# EAGLE board KickerBoard-new-small (EAGLE 9.3.0)
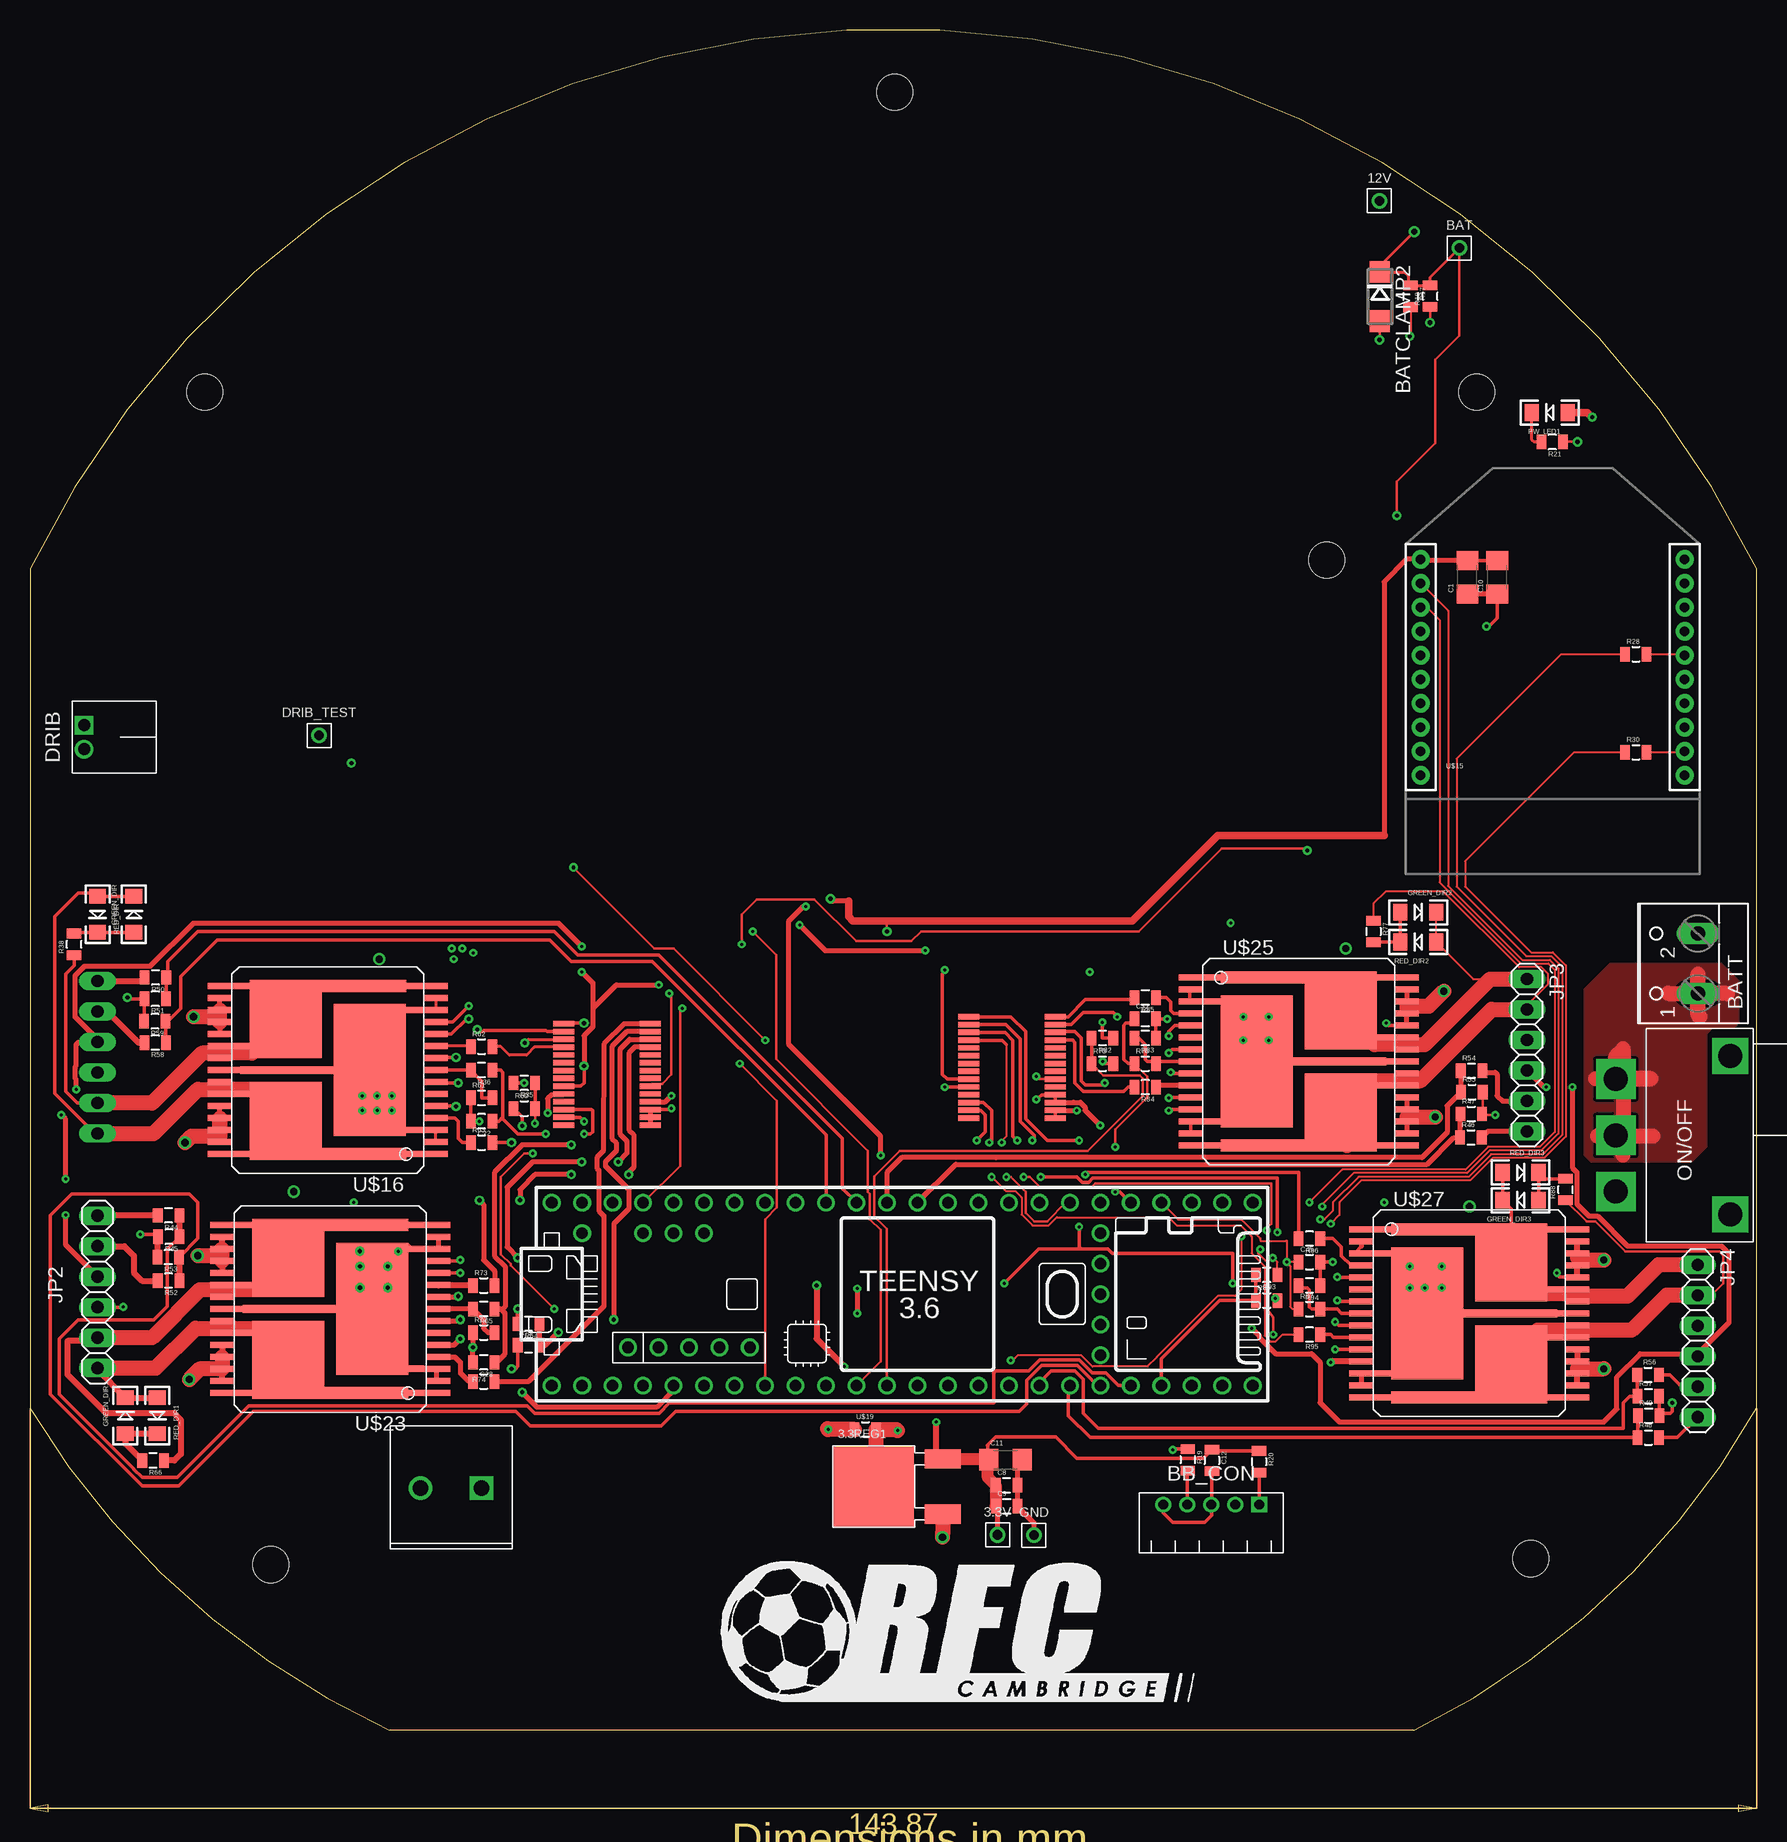
[diagram p2: board, top side]
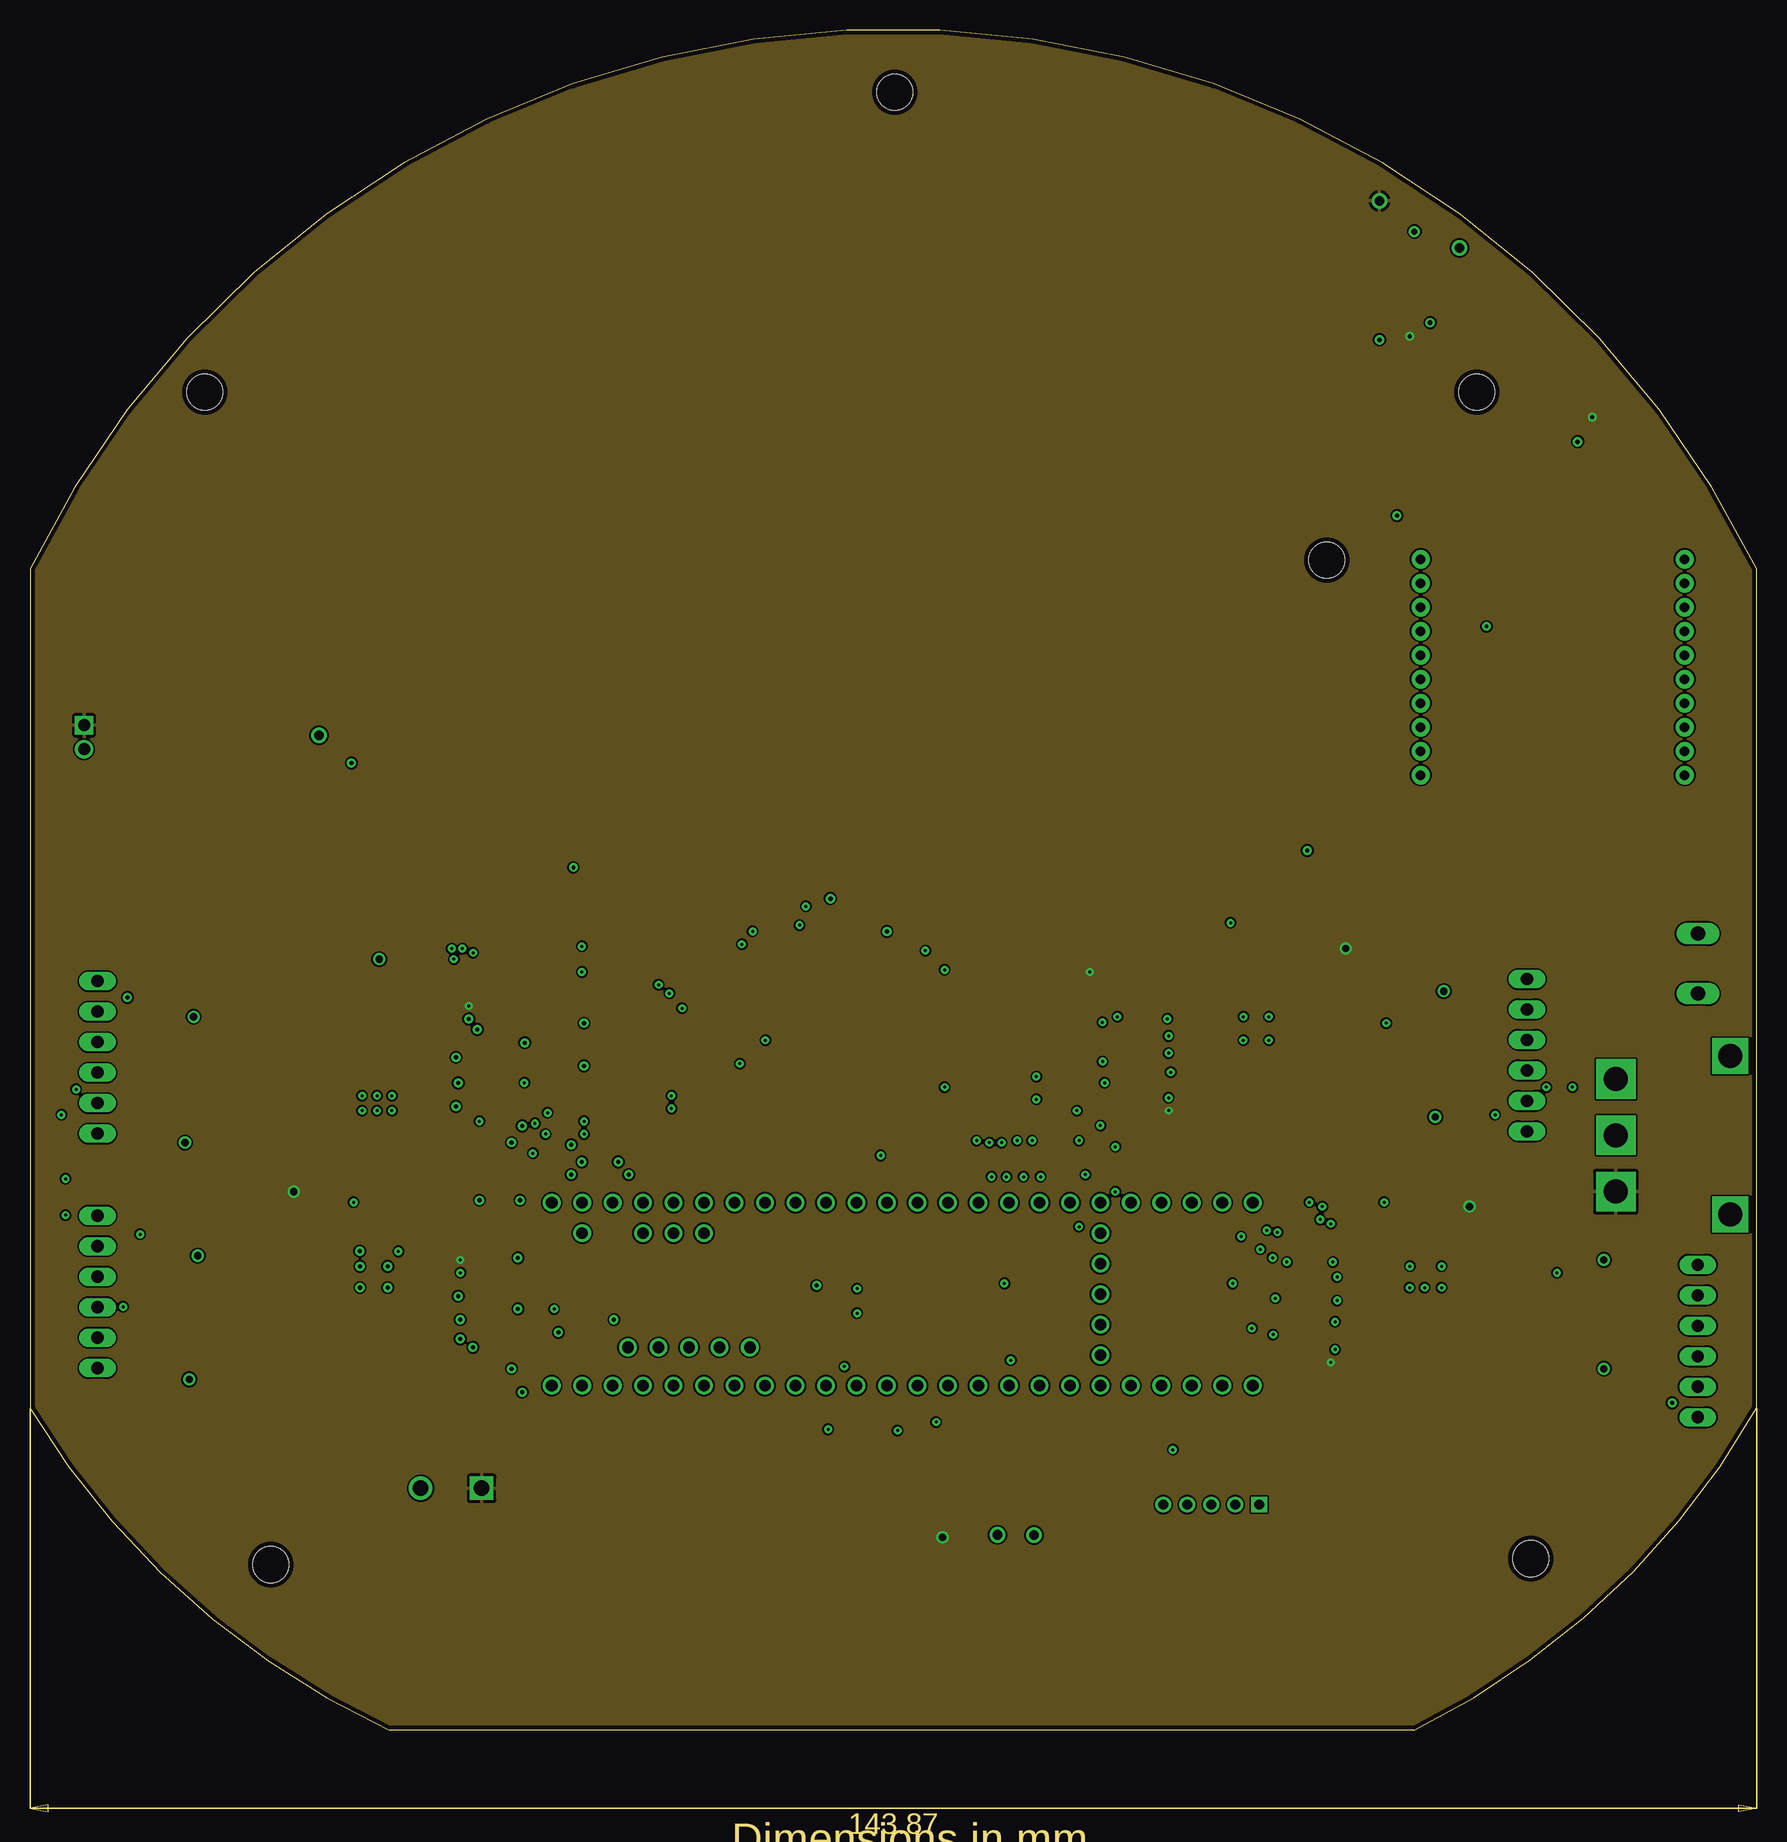
[diagram p3: board, inner layer 12V+]
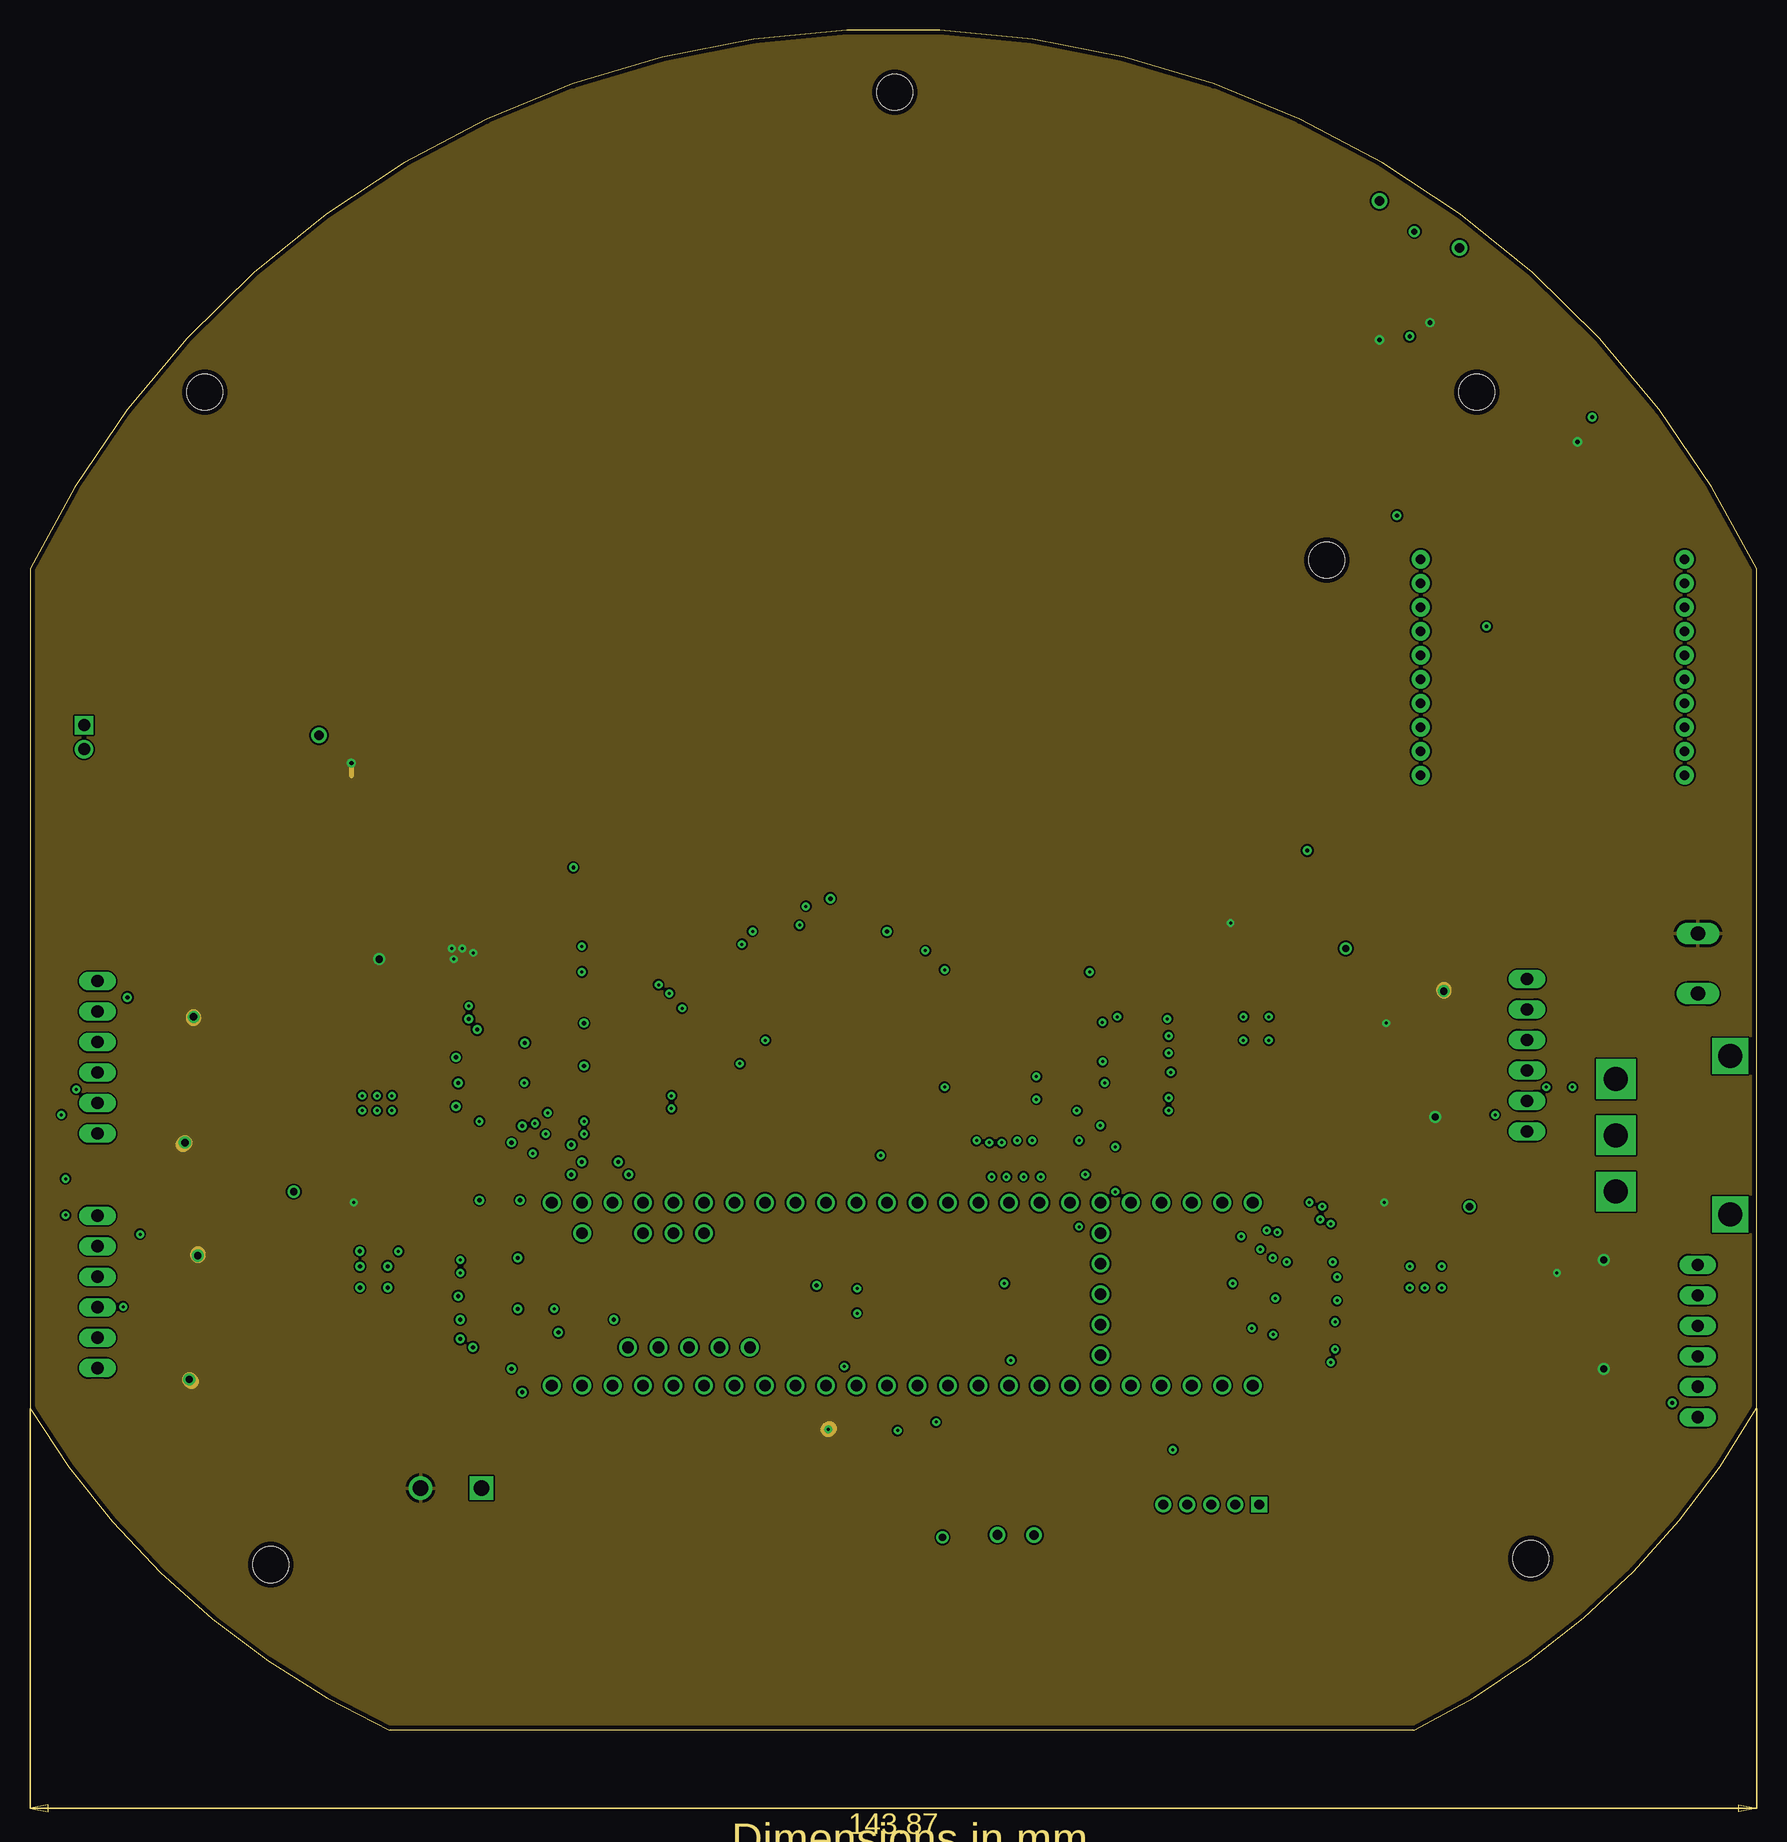
[diagram p4: board, inner layer 12VGND]
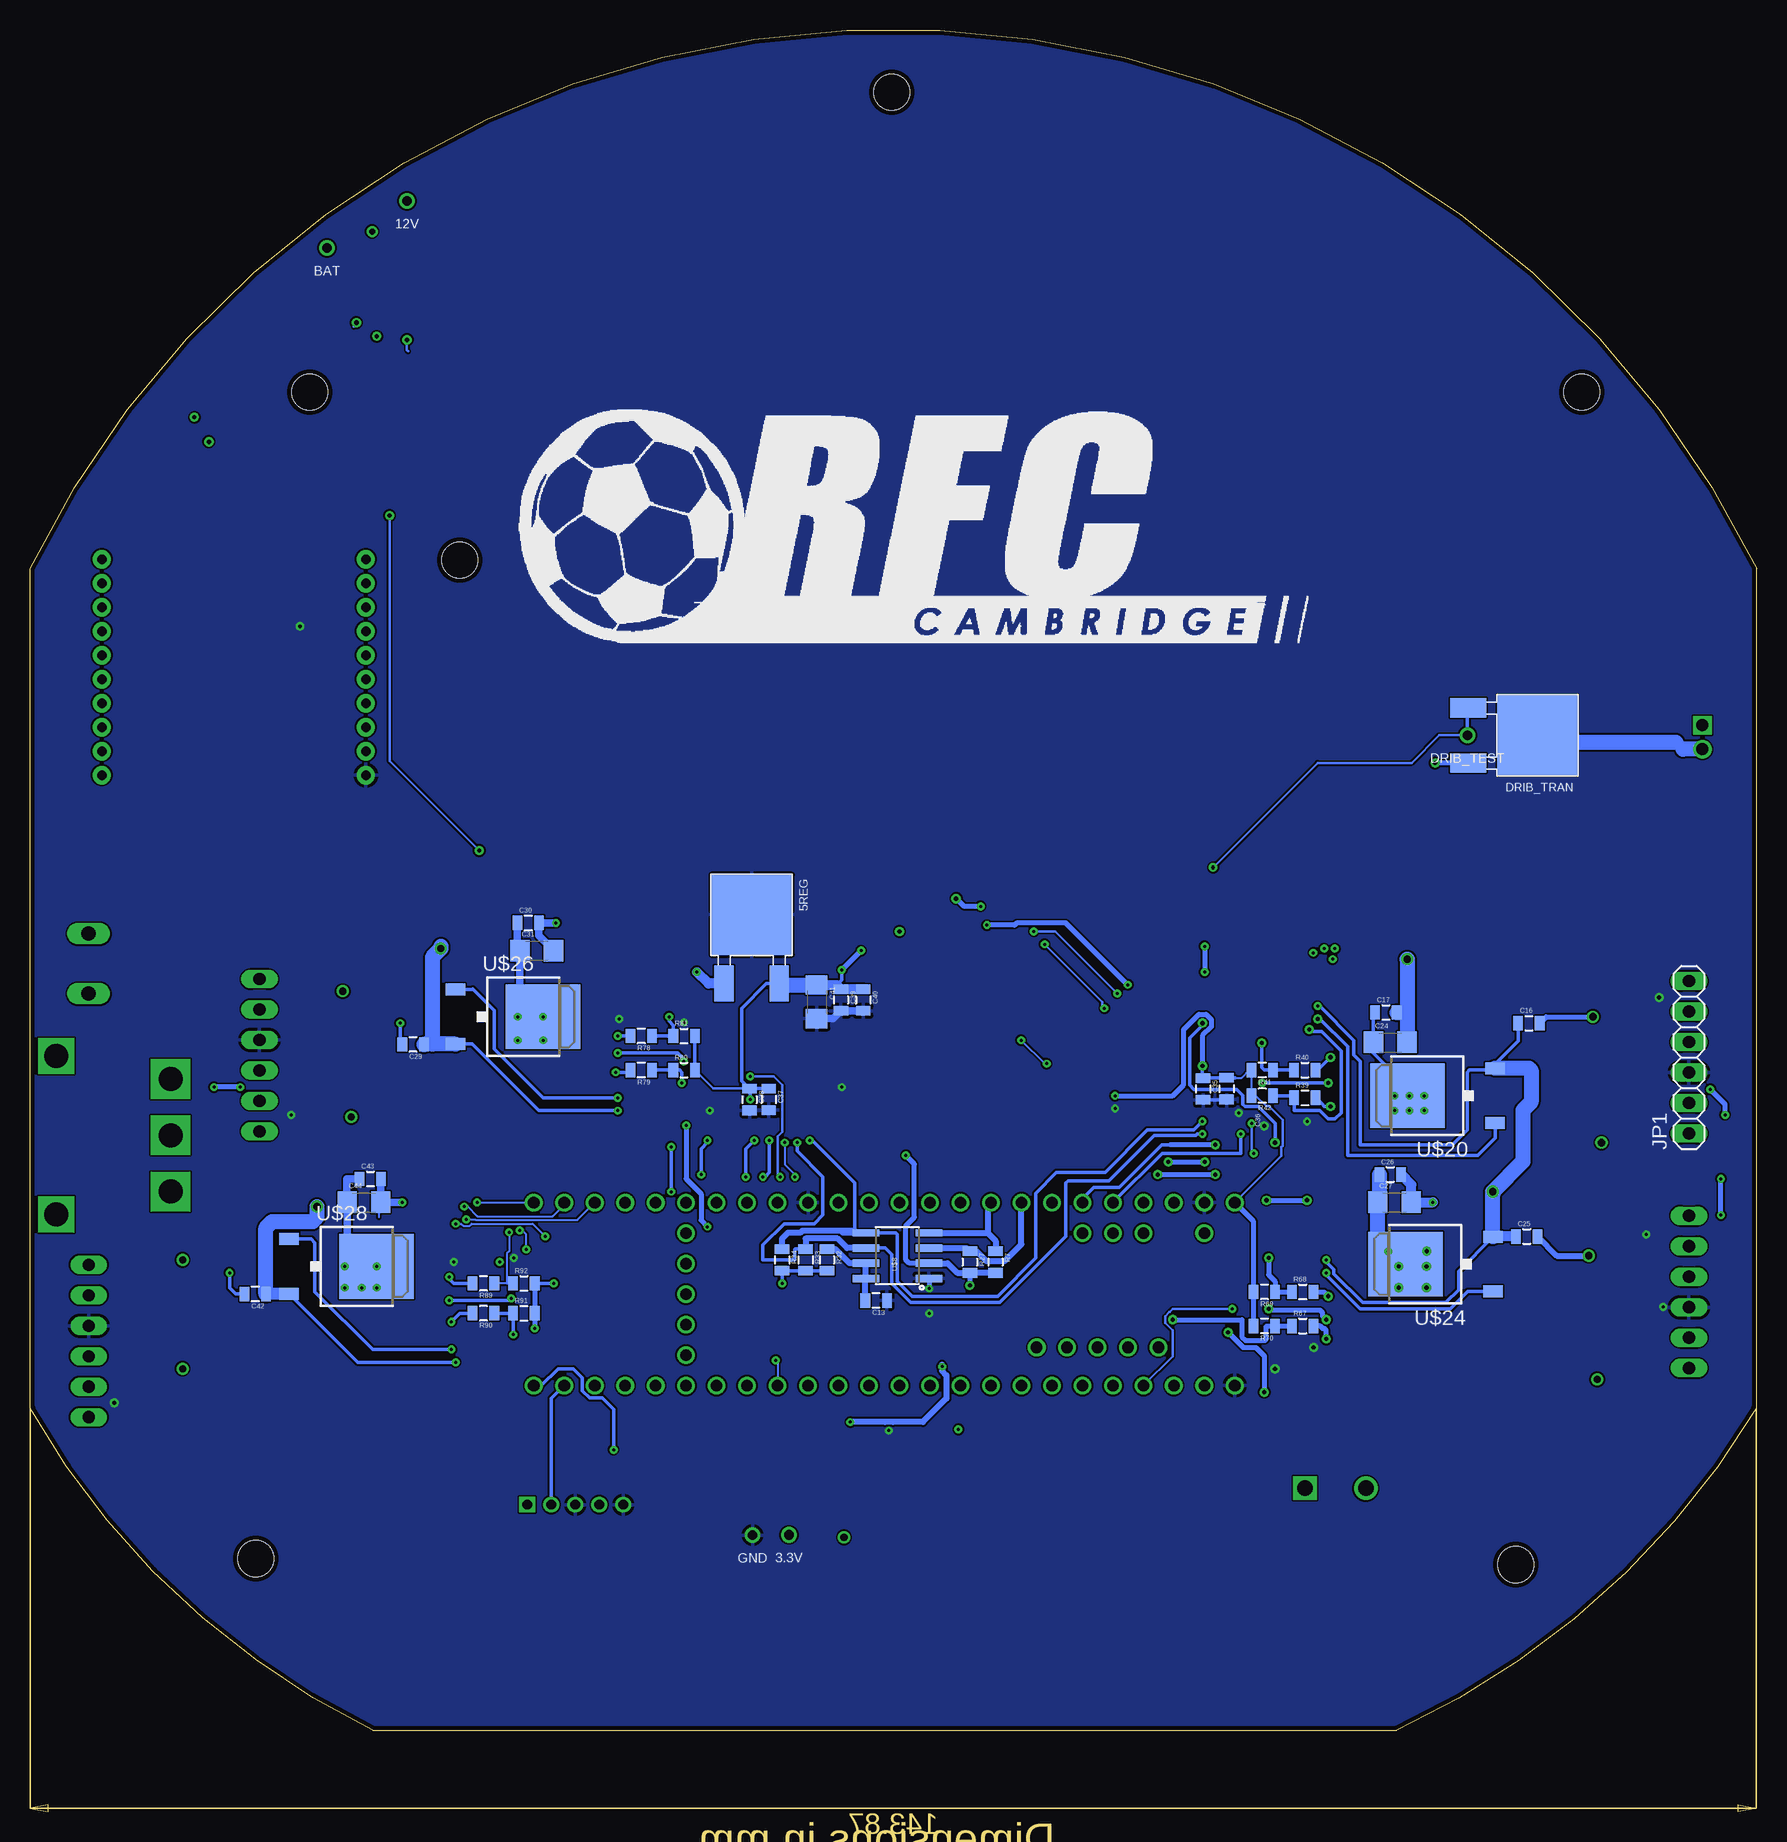
[diagram p5: board, bottom side, seen from below]

Size 143.88 x 141.72 mm. Coordinates in mm from the lower left corner, seen from the top.
Outline: 143.88,26.82 143.88,96.81 arc128 0,96.81 0,26.82 arc34 29.98,0 115.32,0 arc34 143.88,26.82
Copper layers (1*2*3*16): Top(3v3+) 0.035559375mm / dielectric 0.62mm / 12V+ 0.035559375mm / dielectric 0.62mm / 12VGND 0.035559375mm / dielectric 0.62mm / Bottom(3v3GND) 0.035559375mm
Design rules "typical_4pcb *": minimum track width 6mil, minimum drill 8mil, track to track 6mil, track to pad 6mil, pad to pad 6mil, via to via 6mil, smd to smd 6mil, copper to edge 15mil, drill to drill 8mil, minimum pad ring 10mil, minimum via ring 8mil, stop-mask expansion 4mil, vias tented up to drill 0mil, thermal gap 10mil
Holes 3 mm at 125.07,14.3 20.07,13.8 14.57,111.52 72.07,136.52 108.07,97.52 120.57,111.52

## Footprints (pad centres in the part's own frame; a part is rotated, then mirrored left to right if it is on the bottom)
DPAK = smd 6.7 x 6.7: DRAIN 0,0 | smd 3 x 1.6: GATE 5.75,-2.3; SOURCE 5.75,2.3
TESTING_PT = drill 0.8: P$1 0,0
DO214AC = smd 1.8 x 1.7: A 2.05,0; C -2.05,0
W237-102 = drill 1.194 long: 1 -2.5,-1.27; 2 2.5,-1.27
JST-5-2MM = drill 0.8 square: 1 4,0 | drill 0.8: 2 2,0; 3 0,0; 4 -2,0; 5 -4,0
1206 = smd 1.6 x 1.8: 1 -1.4,0; 2 1.4,0
0805 = smd 0.8 x 1.2: 1 -0.9,0; 2 0.9,0
JST-2-2MM = drill 1 square: 1 1,1 | drill 1: 2 -1,1
LED-1206 = smd 1.2 x 1.4: A -1.5,0; C 1.5,0
1X06 = drill 1.016 long: 1 -6.35,0; 2 -3.81,0; 3 -1.27,0; 4 1.27,0; 5 3.81,0; 6 6.35,0
CK_SWITCH = drill 2 pad 3.302 square: COM 0,0; IN1 4.699,0; IN2 -4.699,0 | drill 2 pad 2.54 square: SUP1 -6.604,-9.525; SUP2 6.604,-9.525
SOIC8 = smd 0.61 x 2.21: 1 -1.905,-2.616; 2 -0.635,-2.616; 3 0.635,-2.616; 4 1.905,-2.616; 5 1.905,2.616; 6 0.635,2.616; 7 -0.635,2.616; 8 -1.905,2.616
1X02-PHEONIX = drill 1.3 square: 1 0,0 | drill 1.3: 2 5.08,0
TEENSY_3.5/3.6 = drill 0.965: 0/RX -25.4,-7.62; 1/TX -22.86,-7.62; 2 -20.32,-7.62; 3/CANTX -17.78,-7.62; 3V3 7.62,-7.62; 3V3_2 17.78,-2.54; 3V3_LO -22.86,7.62; 4/CANRX -15.24,-7.62; 5 -12.7,-7.62; 6 -10.16,-7.62; 7 -7.62,-7.62; 8 -5.08,-7.62; 9/CS -2.54,-7.62; 10/CS 0,-7.62; 11/MOSI 2.54,-7.62; 12/MISO 5.08,-7.62; 13/SCK 5.08,7.62; 14/A0 2.54,7.62; 15/A1 0,7.62; 16/A2 -2.54,7.62; 17/A3 -5.08,7.62; 18/A4/SDA -7.62,7.62; 19/A5/SCL -10.16,7.62; 20/A6 -12.7,7.62; 21/A7 -15.24,7.62; 21/DAC0 12.7,7.62; 22/A8 -17.78,7.62; 23/A9 -20.32,7.62; 24 10.16,-7.62; 25 12.7,-7.62; 26 15.24,-7.62; 27 17.78,-7.62; 28 20.32,-7.62; 29 22.86,-7.62; 30 25.4,-7.62; 31/A12 27.94,-7.62; 32/A13 30.48,-7.62; 33/A14 30.48,7.62; 34/A15 27.94,7.62; 35/A16 25.4,7.62; 36/A17 22.86,7.62; 37/A18 20.32,7.62; 38/A19 17.78,7.62; 39/A20 15.24,7.62; A10 -17.78,5.08; A11 -15.24,5.08; A22/DAC1 10.16,7.62; AGND -25.4,7.62; AREF -20.32,5.08; GND -27.94,-7.62; GND2 7.62,7.62; GND3 17.78,0; PROG 17.78,2.54; RESET 17.78,5.08; U5V -21.59,-4.445; UD+ -16.51,-4.445; UD- -19.05,-4.445; UGND1 -13.97,-4.445; UGND2 -11.43,-4.445; VBAT 17.78,-5.08; VIN -27.94,7.62; VUSB -25.4,5.08
XBEE-1 = drill 0.8 pad 1.524: 1 -11,20; 2 -11,18; 3 -11,16; 4 -11,14; 5 -11,12; 6 -11,10; 7 -11,8; 8 -11,6; 9 -11,4; 10 -11,2; 11 11,2; 12 11,4; 13 11,6; 14 11,8; 15 11,10; 16 11,12; 17 11,14; 18 11,16; 19 11,18; 20 11,20
MULTIPOWERSO-30 = smd 0.508 x 12: 1 -7,-4; 15 7,-4; 16 7,4; 30 -7,4 | smd 0.508 x 2: 2 -6,-9; 4 -4,-9; 5 -3,-9; 6 -2,-9; 7 -1,-9; 8 0,-9; 9 1,-9; 10 2,-9; 11 3,-9; 12 4,-9; 14 6,-9; 17 6,9; 18 5,9; 19 4,9; 20 3,9; 22 1,9; 24 -1,9; 26 -3,9; 27 -4,9; 28 -5,9; 29 -6,9 | smd 0.508 x 4: 3 -5,-8; 13 5,-8; 21 2,8; 23 0,8; 25 -2,8 | smd 6.5 x 6: OUTA -4.25,3.5; OUTB 4.25,3.5 | smd 1 x 7.5: OUTA@1 -7,-2.755; OUTB@1 7,-2.755 | smd 11 x 6: VCC 0,-3.5 | smd 0.65 x 8.3: VCC@1 0,3.145
SSOP = smd 0.45 x 1.75: 1 0,0; 2 0.65,0; 3 1.3,0; 4 1.95,0; 5 2.6,0; 6 3.25,0; 7 3.9,0; 8 4.55,0; 9 5.2,0; 10 5.85,0; 11 6.5,0; 12 7.15,0; 13 7.8,0; 14 8.45,0; 15 8.45,7.2; 16 7.8,7.2; 17 7.15,7.2; 18 6.5,7.2; 19 5.85,7.2; 20 5.2,7.2; 21 4.55,7.2; 22 3.9,7.2; 23 3.25,7.2; 24 2.6,7.2; 25 1.95,7.2; 26 1.3,7.2; 27 0.65,7.2; 28 0,7.2
TO252-3 = smd 1 x 1.6: 1 -2.28,-6.07; 2 2.28,-6.07 | smd 5.4 x 6.2: 3 0,1.23

## Placement (x,y rotation side)
3.3REG1  3.3REG1AREG  [DPAK]  70.31,20.31 0 top
3.3V  TEST_PT  [TESTING_PT]  80.63,16.28 0 top
5REG  3.3REG1AREG  [DPAK]  83.73,67.97 270 bottom
12V  TEST_PT  [TESTING_PT]  112.46,127.47 0 top
BAT  TEST_PT  [TESTING_PT]  119.12,123.54 0 top
BATCLAMP2  DIODE-ZENERDO214AC  [DO214AC]  112.48,119.5 270 top
BATT  [W237-102]  137.72,63.91 90 top
BB_CON  JST-5  [JST-5-2MM]  98.43,18.79 0 top
C1  1uF  [1206]  119.78,96.09 90 top
C8  1uF  [0805]  81.38,20.42 0 top
C9  .01uF  [0805]  81.39,18.66 0 top
C10  .01uF  [1206]  122.27,96.09 90 top
C11  47uF  [1206]  81.29,22.56 0 top
C12  4.7uF  [0805]  98.49,22.48 270 top
C13  100nF  [0805]  73.37,35.82 180 bottom
C16  0.1uF  [0805]  18.96,58.93 0 bottom
C17  0.1uF  [0805]  30.88,59.82 0 bottom
C22  33nF  [0805]  37.63,50.75 180 top
C24  47uF  [1206]  30.52,57.33 0 bottom
C25  0.1uF  [0805]  19.14,41.15 0 bottom
C26  0.1uF  [0805]  30.52,46.31 0 bottom
C27  47uF  [1206]  30.17,44 0 bottom
C28  33nF  [0805]  37.81,30.66 180 top
C29  0.1uF  [0805]  111.95,57.15 180 bottom
C30  0.1uF  [0805]  102.35,67.29 0 bottom
C31  47uF  [1206]  101.64,64.98 0 bottom
C32  33nF  [0805]  92.93,59.29 0 top
C35  100nF  [0805]  46.12,53.45 270 bottom
C36  2.2uF  [0805]  44.16,53.47 270 bottom
C37  100nF  [0805]  82.31,52.58 270 bottom
C38  2.2uF  [0805]  83.91,52.56 270 bottom
C39  1uF  [0805]  76.29,60.86 270 bottom
C40  .01uF  [0805]  74.44,60.86 270 bottom
C41  47uF  [1206]  78.32,60.71 270 bottom
C42  0.1uF  [0805]  125.11,36.35 180 bottom
C43  0.1uF  [0805]  115.51,45.95 0 bottom
C44  47uF  [1206]  116.04,44 0 bottom
C45  33nF  [0805]  106.62,39.02 0 top
DRIB  JST-22MM  [JST-2-2MM]  5.5,82.76 90 top
DRIB_TEST  TEST_PT  [TESTING_PT]  24.09,82.92 0 top
DRIB_TRAN  [DPAK]  18.26,82.92 180 bottom
GND  TEST_PT  [TESTING_PT]  83.66,16.26 0 top
GREEN_DIR  [LED-1206]  8.65,68 90 top
GREEN_DIR1  [LED-1206]  7.94,26.22 90 top
GREEN_DIR2  [LED-1206]  115.69,68.18 0 top
GREEN_DIR3  [LED-1206]  124.22,44.17 180 top
JP1  [1X06]  5.63,56.09 90 bottom
JP2  [1X06]  5.63,36.53 90 top
JP3  [1X06]  124.76,56.26 270 top
JP4  [1X06]  138.98,32.44 270 top
ON/OFF  SPDT-SWITCH  [CK_SWITCH]  132.15,49.59 90 top
PW_LED1  [LED-1206]  126.64,109.83 180 top
R7  4.7k  [0805]  63.41,39.02 270 bottom
R17  80k  [0805]  115.05,119.52 270 top
R18  20k  [0805]  116.68,119.54 90 top
R19  20  [0805]  96.48,22.54 270 top
R20  100  [0805]  102.42,22.38 270 top
R21  1k  [0805]  126.85,107.37 180 top
R27  4.7k  [0805]  65.55,39.02 270 bottom
R28  0  [0805]  133.82,89.69 0 top
R30  0  [0805]  133.82,81.51 0 top
R32  200k  [0805]  77.46,39.2 270 bottom
R33  4.7k  [0805]  79.24,39.2 270 bottom
R34  4.7k  [0805]  81.19,39.2 270 bottom
R35  1k  [0805]  41.19,53.95 180 top
R36  10k  [0805]  37.63,55.02 180 top
R38  4.7k  [0805]  3.67,65.51 90 top
R39  1k  [0805]  37.63,52.71 0 bottom
R40  1k  [0805]  37.63,55.02 0 bottom
R41  1k  [0805]  41.19,55.02 180 bottom
R42  1k  [0805]  41.19,52.89 180 bottom
R44  39k  [0805]  11.55,42.9 180 top
R45  75k  [0805]  11.57,41.13 180 top
R46  39k  [0805]  120.08,49.41 0 top
R47  75k  [0805]  120.11,51.36 0 top
R48  39k  [0805]  134.87,24.39 0 top
R49  75k  [0805]  134.89,26.22 0 top
R50  39k  [0805]  10.46,62.74 180 top
R51  75k  [0805]  10.43,60.96 180 top
R52  39k  [0805]  11.55,37.47 180 top
R53  75k  [0805]  11.52,39.42 180 top
R54  39k  [0805]  120.13,54.97 0 top
R55  75k  [0805]  120.16,53.19 0 top
R56  39k  [0805]  134.84,29.62 0 top
R57  75k  [0805]  134.87,27.84 0 top
R58  39k  [0805]  10.43,57.31 180 top
R59  75k  [0805]  10.41,59.08 180 top
R60  10k  [0805]  41.19,51.82 0 top
R61  1k  [0805]  37.63,52.71 0 top
R62  1k  [0805]  37.63,56.98 0 top
R63  1k  [0805]  37.63,48.98 0 top
R64  1k  [0805]  41.55,33.86 180 top
R65  10k  [0805]  37.81,35.11 180 top
R66  4.7k  [0805]  10.25,22.48 180 top
R67  1k  [0805]  37.81,33.68 0 bottom
R68  1k  [0805]  37.81,36.53 0 bottom
R69  1k  [0805]  41.01,36.53 180 bottom
R70  1k  [0805]  41.01,33.68 180 bottom
R71  10k  [0805]  41.55,32.08 0 top
R72  1k  [0805]  37.81,33.15 0 top
R73  1k  [0805]  37.81,37.06 0 top
R74  1k  [0805]  37.81,29.06 0 top
R75  1k  [0805]  89.37,55.55 0 top
R76  10k  [0805]  92.93,55.55 0 top
R77  4.7k  [0805]  111.95,66.58 270 top
R78  1k  [0805]  92.93,57.87 180 bottom
R79  1k  [0805]  92.93,55.02 180 bottom
R80  1k  [0805]  89.37,55.02 0 bottom
R81  1k  [0805]  89.37,57.87 0 bottom
R82  10k  [0805]  89.37,57.69 180 top
R83  1k  [0805]  92.93,57.69 180 top
R84  1k  [0805]  92.93,53.6 180 top
R85  1k  [0805]  92.93,61.07 180 top
R86  1k  [0805]  103.06,35.82 0 top
R87  10k  [0805]  106.62,35.11 0 top
R88  4.7k  [0805]  127.96,45.06 90 top
R89  1k  [0805]  106.09,37.24 180 bottom
R90  1k  [0805]  106.09,34.75 180 bottom
R91  1k  [0805]  102.71,34.75 0 bottom
R92  1k  [0805]  102.71,37.24 0 bottom
R93  10k  [0805]  103.06,37.95 180 top
R94  1k  [0805]  106.62,37.06 180 top
R95  1k  [0805]  106.62,32.97 180 top
R96  1k  [0805]  106.62,40.97 180 top
RED_DIR  [LED-1206]  5.63,68 270 top
RED_DIR1  [LED-1206]  10.61,26.22 270 top
RED_DIR2  [LED-1206]  115.69,65.69 180 top
RED_DIR3  [LED-1206]  124.22,46.49 0 top
U$8  PCA9306  [SOIC8]  71.59,39.55 90 bottom
U$13  PHEONIX-SCREW-TERM  [1X02-PHEONIX]  37.63,20.17 180 top
U$14  TEENSY_3.5/3.6  [TEENSY_3.5/3.6]  71.42,36.35 0 top
U$15  XBEE-1B1  [XBEE-1]  126.89,77.6 0 top
U$16  VNH5019  [MULTIPOWERSO-30]  24.83,55.02 90 top
U$17  IO-EXPANDER  [SSOP]  44.49,58.88 270 top
U$19  INDUCTOR  [0805]  69.61,25.07 0 top
U$20  MOSFET-NCH  [TO252-3]  27.85,52.89 90 bottom
U$21  IO-EXPANDER  [SSOP]  78.25,59.47 270 top
U$23  VNH5019  [MULTIPOWERSO-30]  25.01,35.11 90 top
U$24  MOSFET-NCH  [TO252-3]  28.03,38.84 90 bottom
U$25  VNH5019  [MULTIPOWERSO-30]  105.73,55.73 270 top
U$26  MOSFET-NCH  [TO252-3]  102.35,59.47 270 bottom
U$27  VNH5019  [MULTIPOWERSO-30]  119.96,34.75 270 top
U$28  MOSFET-NCH  [TO252-3]  116.22,38.66 270 bottom

## Tracks (layer width: path | path; a pad name or v marks a point on that pad's centre or on a via)
3.3V  (via drill 0.25, 0.35, 0.38)
  Top(3v3+) 0.203: 71.42,67.47 v71.42,66.58
  Top(3v3+) 0.305: C1.2 C10.2 | R20.1 98.59,23.28 C12.1 97.77,22.66 87.24,22.66 85.46,24.44 80.48,24.44 79.77,23.73 79.83,23.67 79.83,22.62
  Top(3v3+) 0.406: 68.22,69.1 66.91,69.1 v66.69,69.32 | C1.2 116,97.49 U$15.1 114.71,97.6 112.84,95.74 112.84,74.58 | v70.88,47.91 70.88,49.51 63.24,57.15 63.24,67.47 64.48,68.71 64.53,68.66 v64.66,68.66 | 3.3V.P$1 80.63,18.52 C9.1
  Top(3v3+) 0.508: 3.3REG1.SOURCE 75.5,23.17 v75.5,25.68 | v65.55,37.06 65.55,32.62 v67.86,30.31
  Top(3v3+) 0.61: 112.84,74.58 98.97,74.58 91.86,67.47 71.42,67.47 68.57,67.47 68.22,67.82 68.22,69.1
  Top(3v3+) 1.016: 3.3REG1.SOURCE 79.83,22.62 | 79.83,22.62 C11.1 | 79.83,22.62 79.83,21.06 C8.1 C9.1
  Bottom(3v3GND) 0.203: v71.41,66.57 v71.42,66.58
  Bottom(3v3GND) 0.406: R27.2 v65.55,37.06 65.55,36.88 | U$8.2 70.6,38.92 70.88,39.2 70.88,42.04 70.17,42.75 70.17,47.2 v70.88,47.91 | v64.66,68.66 66.03,68.66 v66.69,69.32
  Bottom(3v3GND) 0.508: R7.2 R27.2 66.6,38.12 67.4,38.92 U$8.2 | 67.86,30.48 v67.86,30.31 67.86,29.95 67.5,29.59 67.5,27.64 69.46,25.68 71.98,25.68 72,25.71 72.61,25.71 72.63,25.68 v75.5,25.68
5V  (via drill 0.25, 0.35)
  Top(3v3+) 0.305: v46.17,55.38 46.17,53.95 45.9,53.68 U$17.9 | v83.86,52.58 84.3,52.97 U$21.18 U$21.17 | U$21.9 76.44,54.27 76.04,54.66 76.04,63.02 76.22,63.2 v76.22,63.38 | v81.19,37.24 84.06,40.11 87.6,40.11 | 87.6,40.11 89.8,40.11 90.19,39.73 100.22,39.73 v100.22,37.24 | 87.6,40.11 87.42,40.29 v87.42,41.97
  Top(3v3+) 0.406: JP2.4 2.96,40.47 v2.96,42.93 | v2.96,45.95 2.96,50.93 v2.61,51.29 | v3.85,53.42 3.85,54.25 3.75,54.35 3.75,55.28 3.85,55.38 3.85,57.15 4.05,57.36 JP1.4 5.63,57.55 3.75,59.43 3.75,62.9 4.55,63.7 10.04,63.7 13.6,67.26 44.06,67.26 v45.99,65.33 | v46.17,55.38 46.17,57.89 46.9,58.63 46.9,60.18 | 46.9,60.18 46.9,62.29 v45.99,63.2 | JP3.4 126.15,53.6 v126.36,53.6 | v128.54,53.6 128.54,46.88 128.91,46.51 128.91,43.85 129.91,42.85 130.64,42.85 133.12,40.36 140.95,40.36 141.57,39.74 141.57,33.96 138.98,31.37 | 138.98,31.37 JP4.4 | U$17.18 52.95,52.38 v53.46,52.89 | 46.9,60.18 48.86,62.13 v52.39,62.13 | v64.13,67.11 66.26,64.98 v74.62,64.98 | v101.82,33.51 102.45,32.88 102.45,32.73 103.8,31.37 106.8,31.37 107.51,30.66 107.51,27.28 109.11,25.68 131.16,25.68 132.25,26.78 132.25,29.43 134.18,31.37 138.98,31.37 | U$21.17 86.95,52.31 86.96,52.33 87.52,52.33 87.92,51.93 87.92,51.67 v89.2,50.4
  Bottom(3v3GND) 0.152: 43.44,54.37 42.91,54.37 42.26,55.02 | R41.2 R42.2
  Bottom(3v3GND) 0.203: R80.2 86.94,53.48 84.22,53.48 83.89,53.48 | U$14.VIN 39.59,47.86 39.59,48.61 39.49,48.71 39.49,50.87 40.64,52.02 40.85,52.02 41.72,52.89 R42.2
  Bottom(3v3GND) 0.305: C36.1 44.03,54.37 | 44.03,54.37 43.44,54.37 | 42.26,55.02 R41.2 | 44.03,54.37 44.06,54.34 C35.1 46.12,54.35 46.17,54.31 v46.17,55.38 | R81.2 R80.2 | C38.1 83.89,53.48 C37.1 84.22,53.48 | C38.1 83.86,53.41 v83.86,52.58 | R91.2 R92.2 v100.22,37.24 | R32.2 R33.2 R34.2 v81.19,37.24 | v76.22,63.38 76.22,62.53 76.64,62.11 | C38.1 84.57,54.12 84.57,60.18 82.52,62.22 5REG.SOURCE
  Bottom(3v3GND) 0.406: U$14.VIN 41.91,42.41 R69.2 R70.2 | v2.61,51.29 2.61,52.18 v3.85,53.42 | v2.96,42.93 v2.96,45.95 | v45.99,65.33 v45.99,63.2 | v126.36,53.6 v128.54,53.6 | v53.46,52.89 48.66,52.89 47.74,53.8 47.74,58.4 46.47,59.67 45.86,59.67 45.43,59.24 45.43,58.63 46.17,57.89 v46.17,55.38 | v52.39,62.13 57.55,67.29 61.64,67.29 61.81,67.11 v64.13,67.11 | v74.62,64.98 v76.22,63.38 | R92.2 101.81,33.52 v101.82,33.51 | v89.2,50.4 89.2,45.95 87.95,44.71 87.95,42.5 v87.42,41.97
  Bottom(3v3GND) 0.813: C41.1 76.64,62.11 C39.1 C40.1
  Bottom(3v3GND) 1.27: 5REG.SOURCE 81.32,62.11 C41.1
12V  (via drill 0.25, 0.35, 0.6)
  Top(3v3+) 0.152: R17.2 115.05,116.25 v114.98,116.18
  Top(3v3+) 0.305: U$25.12 94.97,51.73 v94.89,51.64 | U$16.12 35.23,59.02 v36.57,60.35 | v35.86,39.2 35.77,39.11 U$23.12
  Top(3v3+) 0.508: U$27.12 108.49,30.75 v108.4,30.66
  Top(3v3+) 0.61: v130.18,109.44 129.79,109.83 PW_LED1.A
  Top(3v3+) 1.27: 3.3REG1.GATE 76.06,16.46 76.04,16.44 v76.04,16.08
  Bottom(3v3GND) 0.305: C16.1 19.87,57.44 21.78,55.52 U$20.2 21.93,55.02 23.94,55.02 24.12,54.84 24.12,50.04 25.37,48.8 33.01,48.8 33.01,55.73 33.55,56.27 33.55,57.51 36.39,60.35 v36.57,60.35 | v94.89,51.64 101.46,51.64 107.01,57.19 U$26.2 | v108.4,30.66 116.57,30.66 U$28.2 | U$24.2 24.83,38.25 24.83,36.71 25.9,35.64 32.83,35.64 35.22,38.03 35.22,38.39 35.86,39.02 v35.86,39.2
  Bottom(3v3GND) 0.813: 5REG.GATE 87.33,62.22 v88.31,63.2 | C25.1 21.93,41.15 U$24.2
  Bottom(3v3GND) 1.016: U$28.2 124.18,36.38 C42.1
  Bottom(3v3GND) 1.27: U$20.2 21.78,55.2 18.96,55.2 18.79,55.02 18.79,52.35 19.47,51.67 19.47,47.4 v21.99,44.89 21.99,44.71 21.96,44.68 U$24.2 | U$26.2 110.35,57.19 | 110.35,57.19 111.02,57.19 C29.1 | 110.35,57.19 110.35,64.44 v109.64,65.16 109.64,65.33 | C42.1 124.21,41.87 123.69,42.4 120.31,42.4 119.95,42.75 v119.95,43.64
  pour 12V+: -11.79,135.56 -11.79,15.55 17.19,-13.43 132.4,-13.43 151.96,6.13 151.96,125.96 131.51,146.41 -0.95,146.41
12VGND  (via drill 0.25, 0.35, 0.38, 0.6)
  Top(3v3+) 0.203: R21.1 127.73,107.39 v128.97,107.39 | R18.1 v116.68,117.33 | BATCLAMP2.A 112.48,115.92 v112.46,115.9
  Top(3v3+) 0.305: U$27.18 128.96,30.13 U$27.19 | U$27.27 128.96,39.37 U$27.28 | U$25.26 113.22,58.73 v113.02,58.93 | U$27.26 128.93,37.77 127.42,37.77 127.07,38.13 v127.25,38.13
  Top(3v3+) 0.406: U$16.19 U$16.20 | U$16.18 U$16.17 | U$16.27 U$16.26 | U$16.28 15.83,49.51 U$16.29 | U$25.29 U$25.28 114.73,60.35 | 114.73,60.18 U$25.27 U$25.26 | U$25.20 U$25.19 114.73,51.11 U$25.18 U$25.17
  Top(3v3+) 0.508: U$23.26 U$23.27 | U$23.29 U$23.28 | U$23.18 U$23.17 | U$23.19 U$23.20 | U$27.17 U$27.18 | U$27.20 U$27.19 | U$27.26 U$27.27 | U$27.28 U$27.29
  Top(3v3+) 1.27: U$16.18 U$16.19 15.39,59.47 v13.63,59.47 | U$16.28 U$16.27 15.83,49.51 13.45,49.51 v12.92,48.98 | U$23.27 U$23.28 14.14,30.11 v13.28,29.24 | U$23.19 U$23.18 15.46,39.55 v13.99,39.55 | 114.73,60.18 114.73,60.35 116.58,60.35 v117.82,61.6 | 114.73,51.11 v117.11,51.11 | 128.96,30.13 v131.16,30.13 | 128.96,39.37 129.13,39.2 v131.16,39.2 | U$19.1 v66.51,25.07 66.44,25.15
  12VGND 0.406: v26.79,80.62 26.79,79.56
  12VGND 1.27: v13.63,59.47 13.63,59.29 | v12.92,48.98 12.74,48.8 | v13.28,29.24 13.45,29.06 | v13.99,39.55 13.99,39.73 | v117.82,61.6 117.82,61.78 | v66.51,25.07 66.54,25.07 66.61,25.15
  Bottom(3v3GND) 0.152: C43.2 114.8,45.76 114.8,42.75
  Bottom(3v3GND) 0.203: v116.68,117.33 116.68,117.17 116.88,116.97 | v112.46,115.9 112.46,115.04 112.36,114.94
  Bottom(3v3GND) 0.305: v113.02,58.93 113.02,57.32 C29.2 | v127.25,38.13 127.25,36.88 126.71,36.35 C42.2
  Bottom(3v3GND) 0.406: DRIB_TRAN.SOURCE v26.79,80.62 | C16.2 17.53,59.47 v13.63,59.47
  Bottom(3v3GND) 0.508: C25.2 16.64,39.55 v13.99,39.55
  Bottom(3v3GND) 0.61: C43.2 114.64,45.92 C44.2 v112.84,44 | C31.2 101.29,66.02 101.29,66.04 101.46,66.22 C30.2 v100.04,67.29
  Bottom(3v3GND) 0.813: C26.2 28.77,45.45 C27.2 v26.97,44
  Bottom(3v3GND) 1.27: C17.2 29.12,59.82 C24.2 29.12,64.24 v29.1,64.27
  other vias: 35.32,64.27 35.14,65.15 36.03,65.15 36.92,64.8
  pour 12VGND: -16.59,149.25 167.07,149.25 167.07,-24.28 167.78,-24.99 -16.59,-24.99
BAT+
  Top(3v3+) 1.27: ON/OFF.IN1 135.05,54.29 135.07,54.31 132.13,54.31 | 130.45,54.31 132.13,54.31 | 132.13,54.31 ON/OFF.IN1 | ON/OFF.IN1 132.15,56.2 132.76,56.8 132.76,49.52 | 132.76,47.91 132.76,49.52 | ON/OFF.COM 130.7,49.59 130.62,49.51 132.77,49.51 | 135.25,49.51 132.77,49.51 | 132.77,49.51 132.76,49.52 | BATT.1 138.99,63.01 138.98,63.02 138.98,59.64 | 139.16,59.47 138.99,59.63 BATT.1 | 136.49,61.42 138.97,61.42 BATT.1 | 141.46,61.41 BATT.1
  pour Top(3v3+): 131.69,63.91 140.94,63.91 142.36,62.49 142.36,58.93 142,58.58 140.22,58.58 139.69,58.04 139.69,48.62 138.45,47.37 130.09,47.37 129.56,47.91 129.56,61.78
BATSENSE  (via drill 0.25, 0.35, 0.5)
  Top(3v3+) 0.203: v106.44,73.33 106.44,73.51 99.33,73.51 92.4,66.58 74.27,66.58 73.46,65.77 68.84,65.77 65.37,69.24 60.57,69.24 59.33,68 v59.33,65.51 | v113.91,101.25 113.91,104.09 117.11,107.29 117.11,114.23 119.12,116.24 BAT.P$1 | U$14.23/A9 54.17,47.05 54.17,60 v54.35,60.18
  Top(3v3+) 0.254: BAT.P$1 116.68,121.1 R18.2 116.66,120.42 R17.1 114.85,120.62 114.85,121.24 114.54,121.55 BATCLAMP2.C | 112.48,122.04 v115.36,124.92
  Top(3v3+) 0.406: BATCLAMP2.C 112.48,122.04
  Bottom(3v3GND) 0.203: v106.44,73.33 113.91,80.8 v113.91,101.25 | v59.33,65.51 54.52,60.71 54.52,60.35 v54.35,60.18
  Bottom(3v3GND) 0.406: v115.36,124.92 115.1,124.92
BB_IN
  Bottom(3v3GND) 0.305: U$14.31/A12 100.44,27.65 BB_CON.2
BB_OUT  (via drill 0.25)
  Top(3v3+) 0.305: v95.24,23.37 95.31,23.44 R19.1
  Bottom(3v3GND) 0.305: U$14.32/A13 101.26,28.73 99.86,30.13 98.62,30.13 97.86,29.37 97.86,28.3 97.25,27.69 96.18,27.69 95.24,26.75 v95.24,23.37
CS_0  (via drill 0.25)
  Top(3v3+) 0.305: C22.1 39.06,50.75 39.41,51.11 | R36.1 39.23,55.02 39.41,54.84 39.41,51.11 | 39.41,51.11 39.41,50.93 40.66,49.69 v42.97,49.69
  Bottom(3v3GND) 0.305: U$14.22/A8 49.52,48.09 42.97,48.09 v42.97,49.69
CS_1  (via drill 0.35)
  Top(3v3+) 0.406: C28.1 38.88,30.66 39.59,31.37 39.59,34.75 39.32,35.02 | R65.1 39.23,35.11 39.32,35.02 | v45.1,48.8 41.01,48.8 38.7,46.49 38.7,39.55 39.59,38.66 39.59,35.28 39.32,35.02
  Bottom(3v3GND) 0.305: 48.84,48.8 49.55,48.8 53.1,45.24 55.24,45.24 56.18,44.3 U$14.21/A7
  Bottom(3v3GND) 0.406: v45.1,48.8 48.84,48.8
CS_2  (via drill 0.25)
  Top(3v3+) 0.203: v90.44,48.62 90.44,50.08 93.09,52.72 93.09,54.47 92.03,55.53 R76.1
  Top(3v3+) 0.305: C32.1 91.67,58.93 91.33,58.93 91.15,58.75 91.15,55.91 91.51,55.55 R76.1 | U$14.37/A18 90.82,44.89 v90.44,44.89
  Bottom(3v3GND) 0.305: v90.44,44.89 v90.44,48.62
CS_3  (via drill 0.25)
  Top(3v3+) 0.152: C45.1 v104.74,39.02 | v104.74,39.02 105.02,38.67 105.02,35.29 105.2,35.11 R87.1 | 104.66,40.8 102.53,40.8 102.53,40.97 | 104.66,40.8 104.74,40.8 | 104.66,40.8 104.74,40.72 v104.74,39.02
  Top(3v3+) 0.203: U$14.36/A17 95.67,42.57 100.93,42.57 102.53,40.97
CTS  (via drill 0.25)
  Top(3v3+) 0.152: R30.1 128.67,81.51 119.6,72.45 119.6,70.31 125.09,64.83 126.91,64.83 127.98,63.76 127.98,49.48 126.2,47.7 121.9,47.7 120.02,45.83 110.94,45.83 109.11,44 109.11,42.93 v108.4,42.22 | v100.93,41.15 100.93,36.71 100.42,36.2 99,36.2 93.89,31.1 93.89,31.09 93.11,30.31 88.54,30.31 87.6,31.25 82.31,31.25 81.73,30.66 v81.73,30.84
  Bottom(3v3GND) 0.152: v108.4,42.22 107.94,42.22 107.74,42.02 107.28,42.02 107.08,42.22 102,42.22 v100.93,41.15 | v81.73,30.84 81.58,30.69 U$14.24
DRIB  (via drill 0.25, 0.3)
  Top(3v3+) 0.203: 45.46,71.91 v45.28,71.91 52.04,65.16 53.64,65.16 v61.28,57.51 | U$14.6 61.26,42.57 62.25,43.56 62.25,52.45 v59.15,55.55
  Bottom(3v3GND) 0.203: v45.28,71.91 36.57,80.62 28.74,80.62 26.43,82.94 24.1,82.94 DRIB_TEST.P$1 | v61.28,57.51 59.33,55.55 v59.15,55.55
  Bottom(3v3GND) 0.305: DRIB_TEST.P$1 24.09,85.13 DRIB_TRAN.GATE
ENA_0  (via drill 0.35)
  Top(3v3+) 0.305: v37.28,58.4 37.45,58.23 37.71,58.23 37.82,58.34 42.98,58.34 43.09,58.23 U$17.2
  Bottom(3v3GND) 0.305: R42.1 38.71,52.89 R39.1 38.52,52.7 38.52,51.64 36.39,51.64 35.68,50.93 35.14,50.93 34.61,51.46 34.61,56.62 36.21,58.22 37.1,58.22 v37.28,58.4
ENA_1  (via drill 0.35)
  Top(3v3+) 0.406: U$17.27 49.73,58.23 48.48,56.98 48.48,49.33 48.84,48.98 48.84,48.26 47.95,47.38 47.95,47.02 49.9,45.06 49.9,43.46 48.66,42.22 v48.66,34.22
  Bottom(3v3GND) 0.406: R67.1 R70.1 40.83,33.68 40.83,32.62 40.97,32.48 42.57,32.48 42.88,32.79 42.88,34.22 v48.66,34.22
ENA_2  (via drill 0.25)
  Top(3v3+) 0.305: U$21.27 86.77,58.81 87.77,59.82 90.26,59.82 v90.62,59.47
  Bottom(3v3GND) 0.305: R78.1 R81.1 90.26,57.88 90.26,58.75 90.62,59.11 v90.62,59.47
ENA_3  (via drill 0.25)
  Top(3v3+) 0.305: U$21.2 81.31,58.81 82.52,57.61 82.52,50.74 83.68,49.57 83.68,49.15 v83.51,49.15 | v84.22,46.13 87.23,46.13 87.69,45.68 88.21,45.68 88.57,46.03 103.95,46.03 v103.95,41.51
  Bottom(3v3GND) 0.152: R92.1 104.13,37.24 | 104.13,37.24 R89.1 | v103.95,41.51 103.95,39.91 104.13,39.73 104.13,37.24
  Bottom(3v3GND) 0.305: v83.51,49.15 84.22,48.44 v84.22,46.13
ENB_0  (via drill 0.35)
  Top(3v3+) 0.254: v41.23,57.29 41.52,57.58 U$17.3
  Bottom(3v3GND) 0.305: R40.1 R41.1 41.01,55.02 41.23,55.24 v41.23,57.29
ENB_1  (via drill 0.35)
  Top(3v3+) 0.406: v49.01,47.38 49.75,48.11 49.75,49.1 49.19,49.66 49.19,56.8 49.97,57.58 U$17.26 | v45.99,47.38 41.9,47.38 39.77,45.24 39.77,40.26 v40.66,39.37
  Bottom(3v3GND) 0.406: R68.1 R69.1 40.11,37.41 40.66,37.95 v40.66,39.37 | v49.01,47.38 v45.99,47.38
ENB_2  (via drill 0.25)
  Top(3v3+) 0.305: v89.55,53.95 89.37,53.78 87.95,53.78 87.6,54.13 87.6,57.69 87.06,58.23 85.51,58.23 U$21.26
  Bottom(3v3GND) 0.305: R79.1 R80.1 89.73,55.02 89.55,54.84 v89.55,53.95
ENB_3  (via drill 0.25)
  Top(3v3+) 0.152: 103.22,34.91 103.22,38.87 102.35,39.73 102.35,39.91 v102.53,40.09 | v103.06,41.66 103.06,41.86
  Top(3v3+) 0.203: v82.8,46.13 83.32,46.13 84.23,45.22 88.4,45.22 88.76,45.57 103.42,45.57 103.42,42.22 103.06,41.86 | v103.6,32.97 103.6,34.4 103.22,34.91
  Top(3v3+) 0.305: U$21.3 81.25,58.16 81.91,57.51 81.91,49.51 v82.26,49.15
  Bottom(3v3GND) 0.152: v102.53,40.09 102.53,41.33 102.89,41.69 102.91,41.66 v103.06,41.66
  Bottom(3v3GND) 0.305: R90.1 R91.1 103.6,34.74 v103.6,32.97 | v82.26,49.15 82.26,46.49 82.62,46.13 v82.8,46.13
GND  (via drill 0.25, 0.3, 0.35)
  Top(3v3+) 0.152: R93.1 103.95,39.02 v103.55,39.37
  Top(3v3+) 0.203: R55.2 121.06,51.41 R47.2 121.08,51.29 v122.09,51.29
  Top(3v3+) 0.305: C10.1 122.27,92.71 121.38,91.83 v121.38,92 | R59.2 9.53,59.11 R51.2 8.22,60.96 v8.12,61.06 | R61.1 C22.2 v37.46,50.75 | R83.1 C32.2 v94.78,59.29 | C12.2 98.49,18.85 | 98.49,18.85 BB_CON.3 | BB_CON.5 94.44,18.13 95.24,17.33 97.91,17.33 98.49,17.91 98.49,18.85 | R94.1 C45.2 v108.58,39.02 | R57.2 135.79,27.82 R49.2 135.97,26.39 136.67,26.39 136.85,26.57 v136.85,27.28 | U$17.17 53.37,51.73 v53.46,51.82 | JP2.3 7.74,35.26 v7.76,35.28 | R45.2 10.47,41.33 v9.19,41.33 | U$21.10 76.23,53.62 v76.22,53.6 | U$21.16 U$21.15 | R93.1 | 36.91,32.26 v36.91,31.91 | R71.1 40.65,30.32 40.66,30.31 40.48,30.13 v40.12,30.13 | R60.1 41.01,51.1 v41.01,50.37 | R82.1 89.37,57.69 v89.37,59.01
  Top(3v3+) 0.406: C28.2 v36.91,31.91 | R72.1 36.91,32.26 | U$17.17 U$17.16 U$17.15 | C11.2 82.28,22.14 C8.2 C9.2 83.66,17.29 GND.P$1 | C10.1 C1.1 | U$17.10 44.42,52.96 43.47,52.96 43.15,52.64 43.15,51.46 v43.14,51.46 | v68.93,36.81 v68.93,34.75 | U$21.16 85.47,51.64 v87.24,51.64
  Top(3v3+) 0.508: R45.2 10.62,41.08 R53.2
  Top(3v3+) 1.27: 3.3REG1.DRAIN 70.51,20.51 U$19.2 72.2,25.07 v72.3,24.97
  Bottom(3v3GND) 0.305: C35.2 44.19,52.55 C36.2
  Bottom(3v3GND) 0.406: U$8.1 68.93,37.6 v68.93,36.81
  Bottom(3v3GND) 0.61: C40.2 C39.2 76.94,59.31 C41.2
  pour Bottom(3v3GND): 66.08,-10.59 117.47,-10.59 146.09,18.04 146.09,109.07 111.42,143.74 33.01,143.74 -5.04,105.69 -5.04,20.53 25.72,-10.23 65.73,-10.23
INA_0  (via drill 0.35)
  Top(3v3+) 0.305: R63.2 v40.12,48.98 | v46.17,58.93 44.54,58.93 U$17.1
  Bottom(3v3GND) 0.305: v40.12,48.98 40.12,50.58 41.53,51.98 42.62,51.98 42.79,52.16 42.79,52.89 43.32,53.42 46.88,53.42 47.23,53.78 47.23,57.69 45.99,58.93 v46.17,58.93
INA_1
  Top(3v3+) 0.406: R74.2 41.55,29.06 47.82,35.34 47.82,42.88 47.41,43.29 47.41,46.66 47.23,46.84 47.23,47.73 47.77,48.26 47.82,57.19 49.51,58.88 U$17.28
INA_2
  Top(3v3+) 0.305: R85.2 91.85,60.89 87.95,60.89 86.53,59.47 U$21.28
INA_3  (via drill 0.25)
  Top(3v3+) 0.305: R96.2 105.73,46.49 88.13,46.49 v87.95,46.31 | v87.42,49.15 84.75,49.15 82.97,50.93 82.97,58.22 81.73,59.47 U$21.1
  Bottom(3v3GND) 0.305: v87.95,46.31 87.95,48.44 87.42,48.98 v87.42,49.15
INB_0
  Top(3v3+) 0.254: R62.2 39.24,56.98 39.94,56.28 41.38,56.28 42.03,56.93 U$17.4
INB_1  (via drill 0.35)
  Top(3v3+) 0.406: v49.9,46.31 49.72,46.31 50.31,46.89 50.31,49.64 49.9,50.04 49.9,56.44 50.39,56.93 U$17.25 | v45.1,46.31 42.08,46.31 40.83,45.06 v40.83,44.17 | v37.46,44.17 37.81,43.82 37.81,39.2 38.71,38.3 R73.2
  Bottom(3v3GND) 0.406: v49.9,46.31 v45.1,46.31 | v40.83,44.17 v37.46,44.17
INB_2
  Top(3v3+) 0.305: R84.2 91.51,53.6 91.15,53.24 87.77,53.24 87.06,53.95 87.06,57.33 86.88,57.52 U$21.25
INB_3  (via drill 0.25)
  Top(3v3+) 0.152: 81.37,57.15 81.37,49.51 80.97,49.1 v80.97,48.98 | v80.13,46.13 81.32,44.94 82.1,44.94 82.64,44.39 82.64,42.97 83.55,42.07 84.89,42.07 85.57,42.75 94.89,42.75 95.58,42.06 100.89,42.06 101.8,41.15 101.8,39.74 102.88,38.66 102.88,32.91 103.37,32.42 103.83,32.42 104.39,32.97 R95.2
  Top(3v3+) 0.305: U$21.4 81.02,57.51 81.37,57.15
  Bottom(3v3GND) 0.152: v80.97,48.98 80.97,47.15 80.13,46.31 v80.13,46.13
INT1  (via drill 0.25)
  Top(3v3+) 0.203: U$17.20 51.86,53.85 52.67,53.85 53.46,54.64 53.46,61.42 v53.28,61.42 | v60.21,66.58 62.17,64.62 62.17,55.94 69.82,48.29 69.82,44.89 69.99,44.71 69.99,42.57 70.88,41.69 70.88,30.74 U$14.9/CS
  Bottom(3v3GND) 0.203: v53.28,61.42 58.44,66.58 v60.21,66.58
INT2  (via drill 0.25)
  Top(3v3+) 0.203: U$14.39/A20 86.33,43.97 84.75,42.4 83.68,42.4 82.97,43.11 82.97,44.89 81.73,46.13 v81.37,46.13 | v83.86,54.49 84.08,54.27 U$21.20
  Bottom(3v3GND) 0.203: v81.37,46.13 81.55,46.31 81.55,49.51 81.19,49.86 81.19,53.78 81.91,54.49 v83.86,54.49
M1QA-1
  Top(3v3+) 0.508: JP1.5 6.44,59.9 9.03,57.31 R58.2
M1QA-1OUT
  Top(3v3+) 0.305: R58.1 11.3,57.33 R59.1 11.48,59.08 12.56,60.16 12.56,62.84 15.59,65.87 43.32,65.87 45.1,64.09 51.86,64.09 66.34,49.61 U$14.17/A3
M1QA-2
  Top(3v3+) 0.508: JP2.5 7.87,40.34 8.65,39.55 8.65,38.13 9.31,37.47 R52.2
M1QA-2OUT
  Top(3v3+) 0.305: U$14.27 88.93,28.73 87.25,30.41 84.32,30.41 83.08,29.16 83.08,27.21 82.44,26.57 53.82,26.57 52.6,25.35 41.69,25.35 40.47,26.57 18.61,26.57 12.39,20.35 9.34,20.35 1.69,28 1.69,34.57 1.69,34.8 1.69,42.9 3.5,44.71 13.28,44.71 13.99,44 13.99,40.99 R53.1
  Top(3v3+) 0.508: R53.1 12.42,37.49 R52.1
M1QA-3
  Top(3v3+) 0.406: R54.2 121.16,54.84 122.09,54.84 122.27,54.66 122.27,52.89 122.71,52.44 122.72,52.45 JP3.5
M1QA-3OUT
  Top(3v3+) 0.406: R54.1 119.26,54.94 R55.1 118.1,52.03 118.1,49.81 116.02,47.73 80.48,47.73 72.66,47.73 71.42,46.49 U$14.15/A1
M1QA-4
  Top(3v3+) 0.305: JP4.5 137.63,28.63 136.64,29.62 R56.2
M1QA-4OUT
  Top(3v3+) 0.305: R56.1 133.94,27.87 R57.1 133.32,27.84 132.76,27.28 132.76,25.15 89.02,25.15 87.77,26.39 87.77,29.24 87.06,29.95 85.11,29.95 84.12,28.96 U$14.25
M1QB-1
  Top(3v3+) 0.508: JP1.6 9.25,62.44 R50.2
M1QB-1OUT
  Top(3v3+) 0.305: R51.1 11.36,60.99 R50.1 11.5,62.88 11.5,64.09 13.99,66.58 43.68,66.58 45.63,64.62 52.39,64.62 67.68,49.33 67.68,45.75 | 67.68,45.75 67.68,45.16 U$14.16/A2 | 67.68,45.75
M1QB-2
  Top(3v3+) 0.508: R44.2 5.65,42.9 JP2.6
M1QB-2OUT
  Top(3v3+) 0.305: U$14.28 90.67,28.73 89.63,29.77 88.53,29.77 87.44,30.87 84.13,30.87 83.22,29.95 80.48,29.95 80.31,29.77 80.31,27.28 53.29,27.28 52.42,26.42 42.05,26.42 41.44,27.03 18.24,27.03 12.27,21.06 9.34,21.06 8.65,21.76 8.65,21.78 2.43,28 2.43,32.62 4,34.19 10.32,34.19 11.46,35.33 11.46,40.11 R45.1
  Top(3v3+) 0.508: R45.1 12.47,42.88 R44.1
M1QB-3
  Top(3v3+) 0.406: JP3.6 121.49,49.91 R46.2
M1QB-3OUT
  Top(3v3+) 0.406: R47.1 119.18,51.34 R46.1 118.66,49.41 116.43,47.17 77.16,47.17 U$14.14/A0
M1QB-4
  Top(3v3+) 0.305: JP4.6 137.28,24.39 R48.2
M1QB-4OUT
  Top(3v3+) 0.305: R49.1 133.97,26.19 R48.1 88.36,24.39 86.53,26.22 86.53,28.6 U$14.26
N$4
  Top(3v3+) 0.152: R28.2 137.8,89.69 U$15.16
N$16
  Top(3v3+) 0.152: R30.2 137.8,81.51 U$15.12
N$23
  Top(3v3+) 0.254: R21.2 125.38,107.37 125.14,107.59 PW_LED1.C
N$25
  Top(3v3+) 0.305: GREEN_DIR.A RED_DIR.C 3.76,66.5 R38.2
N$26
  Top(3v3+) 0.305: U$16.8 R36.2 37.62,54.13 37.63,54.13 37.63,52.71 R61.2
N$27  (via drill 0.25, 0.35)
  Top(3v3+) 0.305: R35.2 v41.19,53.95 | v35.68,53.95 33.9,53.95 U$16.7
  Bottom(3v3GND) 0.305: v41.19,53.95 v35.68,53.95
N$28  (via drill 0.35)
  Top(3v3+) 0.305: v35.5,52 35.68,52 35.66,52.02 U$16.5
  Bottom(3v3GND) 0.305: R39.2 36.21,52.18 36.02,52 v35.5,52
N$31  (via drill 0.35)
  Top(3v3+) 0.305: v35.5,56.09 33.9,56.09 U$16.9
  Bottom(3v3GND) 0.305: R40.2 36.57,55.02 v35.5,56.09
N$32
  Top(3v3+) 0.305: BB_CON.4 96.44,21.6 R19.2
N$37
  Top(3v3+) 0.254: R62.1 36.69,57.02 U$16.10
N$38
  Bottom(3v3GND) 0.508: R32.1 77.45,40.09 76.75,40.09 75.58,38.92 U$8.7 U$8.8 74.27,37.59 C13.2
N$39
  Top(3v3+) 0.305: R63.1 36.03,48.98 35.68,49.33 35.68,50.75 35.41,51.02 U$16.4
N$40
  Top(3v3+) 0.305: BB_CON.1 102.44,21.46 R20.2
N$41  (via drill 0.35)
  Top(3v3+) 0.305: U$16.11 35.12,58.02 36.39,59.29 v36.57,59.29
  Bottom(3v3GND) 0.305: U$20.1 21.78,49.36 23.23,47.91 34.08,47.91 34.08,56.98 36.39,59.29 v36.57,59.29
N$42  (via drill 0.25)
  Top(3v3+) 0.254: U$16.2 33.83,49.75 33.55,50.04 33.52,50.02 U$16.3 | U$16.14 33.83,60.11 33.72,60 33.7,60.02 U$16.13
  Top(3v3+) 0.305: U$16.13 30.19,60.02 30.19,54.84 30.19,53.98 | U$16.VCC 27.98,54.66 27.98,53.48 27.68,53.78 | v27.68,51.64 27.85,51.46 | U$16.3 32.81,50.04 28.57,50.04 27.98,50.63
  Top(3v3+) 0.406: U$16.VCC 28.51,54.84 30.19,54.84 | U$16.VCC 28.33,52.3 v27.68,51.64 | U$16.VCC 28.33,50.99 27.98,50.63 | U$16.VCC 28.33,52.23 v28.92,51.64 | U$16.VCC 28.33,53.54 v27.68,52.89 | U$16.VCC 28.33,53.48 v28.92,52.89 v30.17,51.64
  Top(3v3+) 0.508: U$16.23 U$16.VCC@1 U$16.VCC
  Bottom(3v3GND) 0.305: C17.1 31.95,59.64 31.95,57.37 C24.1 31.92,56.44 30.25,54.76
  Bottom(3v3GND) 0.406: U$20.3 v28.92,52.89 | U$20.3 30.25,54.05 30.25,54.76 | U$20.3 v30.17,52.89
N$43
  Top(3v3+) 0.508: RED_DIR1.C GREEN_DIR1.A 7.94,23.89 R66.2
N$44
  Top(3v3+) 0.406: R72.2 38.17,33.15 37.81,33.51 37.81,34.22 37.8,34.22 R65.2 U$23.8
N$45  (via drill 0.35)
  Top(3v3+) 0.406: U$23.7 35.57,34.11 35.68,34.22 v35.86,34.22 | v40.66,35.11 40.66,33.87 R64.2
  Bottom(3v3GND) 0.406: v35.86,34.22 36.16,34.52 36.16,34.79 36.36,34.99 40.37,34.99 40.66,35.28 v40.66,35.11
N$46  (via drill 0.35)
  Top(3v3+) 0.406: U$23.5 35.34,32.11 v35.86,32.62
  Bottom(3v3GND) 0.406: v35.86,32.62 35.86,33.33 36.01,33.48 36.16,33.48 36.36,33.68 R67.2
N$47  (via drill 0.35)
  Top(3v3+) 0.406: U$23.9 35.61,36.11 v35.68,36.17
  Bottom(3v3GND) 0.406: R68.2 36.03,36.53 v35.68,36.17
N$48  (via drill 0.25)
  Top(3v3+) 0.305: v35.86,38.13 35.83,38.11 U$23.11
  Bottom(3v3GND) 0.305: U$24.1 24.07,36.56 25.5,35.12 33.03,35.12 36.03,38.13 v35.86,38.13
N$49  (via drill 0.25, 0.35)
  Top(3v3+) 0.152: U$23.3 32.81,30.31 29.45,30.31 28.51,31.25 U$23.VCC
  Top(3v3+) 0.203: U$23.VCC U$23.23
  Top(3v3+) 0.305: U$23.VCC@1 25.72,35.11 v27.5,36.88
  Top(3v3+) 0.406: U$23.14 34.01,40.2 33.9,40.09 33.88,40.11 U$23.13 31.74,40.11 31.41,40.44 30.88,39.91 v30.7,39.91 | v29.81,38.66 29.28,38.84 U$23.VCC 27.32,38.66 v27.5,38.66 | v27.5,36.88 v29.81,36.88 | U$23.2 33.9,29.22 33.9,30.13 33.03,30.13 U$23.3
  Bottom(3v3GND) 0.406: v27.5,38.66 v27.5,36.88 | v27.48,39.93 30.37,38.36 29.78,39.35 U$24.3 29.26,39 30.17,39.91 v30.7,39.91 31.57,39.91
  Bottom(3v3GND) 1.27: C26.1 31.42,44.14 C27.1 31.57,39.91 | v29.81,38.66 29.28,38.13 29.26,38.14 U$24.3
N$50
  Top(3v3+) 0.508: R73.1 34.05,37.06 U$23.10
N$51
  Top(3v3+) 0.406: R74.1 36.57,29.06 35.86,29.77 35.86,30.66 35.41,31.11 U$23.4
N$52
  Top(3v3+) 0.305: R77.2 111.97,65.69 RED_DIR2.C GREEN_DIR2.A
N$53
  Top(3v3+) 0.305: U$25.8 94.01,55.73 | R76.2 93.65,55.73 93.11,55.73 92.93,55.91 92.93,57.15 92.4,57.69 R83.2
  Top(3v3+) 0.406: 94.01,55.73 R76.2
N$54  (via drill 0.25)
  Top(3v3+) 0.305: U$25.7 95.17,56.73 v94.89,56.44 | v89.39,55.73 89.57,55.55 R75.2
  Bottom(3v3GND) 0.305: v94.89,56.44 89.91,56.44 89.37,55.91 89.39,55.89 v89.39,55.73
N$55  (via drill 0.25)
  Top(3v3+) 0.305: U$25.5 95.4,58.73 94.89,58.22 v94.89,57.87
  Bottom(3v3GND) 0.305: v94.89,57.87 R78.2
N$56  (via drill 0.25)
  Top(3v3+) 0.305: U$25.9 95.17,54.73 v95.06,54.84
  Bottom(3v3GND) 0.305: R79.2 94.01,54.84 v95.06,54.84
N$57  (via drill 0.25)
  Top(3v3+) 0.305: U$25.11 94.91,52.73 v94.89,52.71
  Bottom(3v3GND) 0.305: v94.89,52.71 101.11,52.71 105.2,56.8 105.2,60 106.98,61.78 107.01,61.75 U$26.1
N$58  (via drill 0.25)
  Top(3v3+) 0.152: U$25.23 U$25.VCC@1 U$25.VCC
  Top(3v3+) 0.305: U$25.2 96.66,61.66 96.66,60.89 96.82,60.73 U$25.3 99.49,60.73 101.11,59.11 v101.11,57.51 | U$25.14 96.73,50.69 96.69,50.73 U$25.13 101.27,50.73 102.23,51.7 U$25.VCC 102.23,58.36 U$26.3 | v103.24,59.47 103.06,59.29 103.06,57.87 103.24,57.87 v103.24,57.51
  Bottom(3v3GND) 0.305: U$26.3 102.53,59.47 v103.24,59.47 | v103.24,57.51 v101.11,57.51
  Bottom(3v3GND) 0.61: 102.53,59.47 103.04,59.98 C31.1 103.25,65.19 C30.1
  other vias: 101.12,59.47
N$59
  Top(3v3+) 0.406: U$25.10 93.96,53.73 R84.1
N$60
  Top(3v3+) 0.305: U$25.4 95.33,59.73 95.06,60 95.06,60.71 94.71,61.06 R85.1
N$61
  Top(3v3+) 0.305: RED_DIR3.C 125.72,46.31 | 125.72,46.31 GREEN_DIR3.A | R88.2 126.07,45.96 125.72,46.31
N$62
  Top(3v3+) 0.305: R94.2 105.9,36.88 106.44,36.88 106.62,36.71 106.62,35.28 106.8,35.11 R87.2 108.93,35.11 109.29,34.75 U$27.8
N$63  (via drill 0.25)
  Top(3v3+) 0.305: U$27.7 109,35.75 v108.93,35.82 | v103.78,36 103.79,36 R86.2
  Bottom(3v3GND) 0.305: v108.93,35.82 103.78,35.82 v103.78,36
N$64  (via drill 0.25)
  Top(3v3+) 0.305: v108.93,37.77 108.95,37.75 U$27.5
  Bottom(3v3GND) 0.305: R89.2 108.58,37.24 108.93,37.6 v108.93,37.77
N$66  (via drill 0.25)
  Top(3v3+) 0.305: U$27.9 109.04,33.75 v108.75,34.04
  Bottom(3v3GND) 0.305: v108.75,34.04 108.04,34.75 R90.2
N$67  (via drill 0.25)
  Top(3v3+) 0.305: U$27.11 108.78,31.75 v108.75,31.73
  Bottom(3v3GND) 0.305: v108.75,31.73 115.33,31.73 120.13,36.53 120.13,40.62 120.46,40.94 U$28.1
N$68  (via drill 0.25)
  Top(3v3+) 0.152: U$27.13 111.98,29.77 116.22,29.77 116.45,30.01 U$27.VCC | U$27.23 U$27.VCC@1 119.78,34.75 v117.64,36.88 | U$27.3 113.9,39.75 U$28.3
  Top(3v3+) 0.305: 110.95,40.33 110.38,39.75 U$27.3
  Top(3v3+) 0.406: U$27.2 110.95,40.33 | U$27.13 110.91,29.75 110.95,29.7 U$27.14
  Top(3v3+) 0.61: U$28.3 v117.64,38.66 | v117.64,36.88 117.47,36.71 114.98,36.71 v114.98,36.88 | v116.22,36.88 116.45,36.65 U$27.VCC
  Bottom(3v3GND) 0.61: C43.1 117.47,45.95 117.47,44.02 C44.1 117.44,41.12 U$28.3 | v117.64,38.66 117.47,38.48 117.47,36.71 | 117.47,36.53 117.47,36.71 | 117.47,36.71 v117.64,36.88 | v114.98,36.88 v116.22,36.88
  other vias: 114.99,38.66
N$69
  Top(3v3+) 0.305: U$27.10 108.62,32.75 108.4,32.97 R95.1
N$70
  Top(3v3+) 0.305: U$27.4 110.09,38.75 109.29,39.55 109.29,40.26 108.58,40.97 R96.1
OUTA_0
  Top(3v3+) 0.254: U$16.24 15.83,53.89 16.3,53.42 16.43,53.42 U$16.25 | U$16.OUTA 19.68,52.43 19.68,53.42
  Top(3v3+) 0.305: GREEN_DIR.C RED_DIR.A 5.35,69.78 4.03,69.78 2.07,67.82 2.07,53.06 5.4,49.74 JP1.1
  Top(3v3+) 0.508: U$16.OUTA 20.83,50.27 U$16.30 U$16.OUTA@1 U$16.1
  Top(3v3+) 1.27: JP1.1 10.3,49.74 13.99,53.42 16.3,53.42 19.68,53.42
OUTA_1
  Top(3v3+) 0.152: U$23.OUTA@1 U$23.1 21.16,28.11 21.09,28.18 | U$23.30 21.09,28.18 | 21.09,28.18 21.51,28.61 U$23.OUTA
  Top(3v3+) 0.305: 17.01,33.51 U$23.25
  Top(3v3+) 0.508: RED_DIR1.A GREEN_DIR1.C 5.63,30.03 JP2.1 | 17.01,33.51 16.61,33.51 U$23.24
  Top(3v3+) 1.27: JP2.1 10.48,30.18 13.81,33.51 17.01,33.51 18.86,33.51 U$23.OUTA
OUTA_2
  Top(3v3+) 0.152: GREEN_DIR2.C RED_DIR2.A 120.26,62.61 121.68,62.61 | U$25.30 109.23,62.23 109.23,62.13 U$25.OUTA
  Top(3v3+) 0.305: U$25.OUTA@1 U$25.1 108.63,62.73 109.23,62.13
  Top(3v3+) 0.508: U$25.24 114.38,57.09 U$25.25
  Top(3v3+) 1.27: 114.38,57.09 114.44,57.15 | 114.44,57.15 116.22,57.15 121.68,62.61 JP3.1 | 114.44,57.15 112.06,57.15 U$25.OUTA
OUTA_3
  Top(3v3+) 0.305: RED_DIR3.A GREEN_DIR3.C 123.45,43.44 123.45,41.86 | 123.45,41.86 U$27.OUTA | U$27.1 123.34,41.75 123.45,41.86 | U$27.25 128.36,36.35 129.02,36.35 | U$27.24 129.2,36 129.2,36.17
  Top(3v3+) 0.508: U$27.OUTA@1 U$27.1 | U$27.OUTA 123.45,41.25 U$27.30
  Top(3v3+) 1.27: JP4.1 135.73,38.79 133.11,36.17 129.2,36.17 129.02,36.35 124.58,36.35 123.45,37.47 U$27.OUTA
OUTB_0
  Top(3v3+) 0.305: U$16.16 21.33,61.52 U$16.OUTB 24.08,62.02 U$16.OUTB@1 U$16.15 | R38.1 3.67,63.73 2.96,63.02 2.96,53.24 3.93,52.28 JP1.2
  Top(3v3+) 0.508: U$16.22 15.83,56.44 15.83,56.69 15.94,56.8 15.94,56.98 15.99,57.02 U$16.21
  Top(3v3+) 1.27: 19.19,58.61 19.14,58.57 19.14,56.8 18.96,56.8 | 19.19,58.61 19.65,59.08 21.14,59.08 U$16.OUTB | 19.19,58.61 19.19,57.13 18.51,56.44 15.83,56.44 14.34,56.44 10.18,52.28 JP1.2
OUTB_1
  Top(3v3+) 0.305: U$23.21 19.26,37.11 U$23.OUTB 21.51,41.61 U$23.16 U$23.OUTB@1 U$23.15
  Top(3v3+) 0.508: JP2.2 5.35,32.44 3.14,32.44 3.14,29.62 6.37,26.39 12.03,26.39 12.56,25.86 12.56,23.02 12.03,22.48 R66.1 | 16.65,36.71 16.61,36.71 U$23.22
  Top(3v3+) 1.27: U$23.OUTB 18.86,36.71 16.65,36.71 14.16,36.71 10.18,32.72 JP2.2
OUTB_2
  Top(3v3+) 0.152: JP3.2 124.76,60.45 126.51,62.2 126.51,63.03 125.93,63.61 124.1,63.61 117.78,69.92 112.98,69.92 111.95,68.89 R77.1 | U$25.16 U$25.OUTB@1
  Top(3v3+) 0.406: U$25.21 113.78,53.78 114.62,53.78 114.73,53.89 114.73,54.13 U$25.22
  Top(3v3+) 0.508: U$25.15 U$25.OUTB@1
  Top(3v3+) 1.27: 111.53,53.78 U$25.OUTB | JP3.2 121.81,60.08 115.87,54.13 114.73,54.13 111.88,54.13 111.53,53.78 | 111.53,53.78 109.64,53.78 109.64,48.82 U$25.16
OUTB_3
  Top(3v3+) 0.203: R88.1 129.72,42.4 130.45,42.4 132.94,39.91 140.76,39.91 141.11,39.55 141.11,37.24 140.12,36.25 JP4.2
  Top(3v3+) 0.254: 123.69,31.37 123.69,27.93 123.51,27.75
  Top(3v3+) 0.305: U$27.15 123.51,27.75 U$27.16 | U$27.OUTB 125.75,32.8 127.91,32.8 U$27.21 128.89,32.75 128.96,32.69 | 129.02,32.62 128.96,32.69 | 128.96,32.69 128.96,33.33 U$27.22
  Top(3v3+) 0.508: U$27.OUTB@1 U$27.15
  Top(3v3+) 1.27: JP4.2 136.39,36.25 133.47,33.33 128.96,33.33 125.64,33.33 123.69,31.37
PWM0  (via drill 0.25)
  Top(3v3+) 0.203: v43.68,35.11 40.05,38.74 40.05,38.85 39.23,39.66 39.23,46.13 41.19,48.09 v41.9,48.09 | R60.2 v42.09,50.58 v42.08,50.58
  Top(3v3+) 0.305: R60.2 R35.1
  Bottom(3v3GND) 0.203: U$14.2 48.66,31.17 48.66,33.32 49.29,33.96 49.29,34.48 48.92,34.85 48.91,34.85 48.66,35.11 v43.68,35.11 | v42.08,50.58 42.08,48.26 v41.9,48.09
PWM1  (via drill 0.35)
  Top(3v3+) 0.406: R64.1 R71.2 42.97,32.08 v44.03,33.15 | U$14.3/CANTX 53.64,28.35 52.21,26.93 42.26,26.93 v41.01,28.17
  Bottom(3v3GND) 0.406: v44.03,33.15 42.79,31.91 41.72,31.91 41.01,31.2 v41.01,28.17
PWM2
  Top(3v3+) 0.203: R75.1 89.44,54.59 92.47,54.59 92.73,54.32 92.73,52.87 88.13,48.26 72.48,48.26 70.38,46.16 70.38,42.83 71.42,41.79 U$14.10/CS
  Top(3v3+) 0.305: R82.2 R75.1
PWM3
  Top(3v3+) 0.305: R93.2 R86.1 99.15,35.82 94.28,30.94 U$14.29
RTS  (via drill 0.25)
  Top(3v3+) 0.152: R28.1 127.6,89.69 118.89,80.98 118.89,70.31 124.68,64.52 126.79,64.52 127.68,63.63 127.68,49.61 126.08,48.01 121.77,48.01 119.89,46.13 110.71,46.13 108.58,44 108.58,43.29 107.86,42.57 v107.51,42.57
  Top(3v3+) 0.203: 132.94,89.68 R28.1
  Bottom(3v3GND) 0.152: v107.51,42.57 106.77,42.57 106.72,42.52 98.26,42.52 U$14.35/A16
RX  (via drill 0.25)
  Top(3v3+) 0.152: U$15.2 118.18,93.31 118.18,70.39 124.35,64.22 126.66,64.22 127.37,63.5 127.37,49.74 125.95,48.31 121.64,48.31 119.77,46.44 110.3,46.44 107.51,43.64 v107.69,43.64
  Bottom(3v3GND) 0.152: v107.69,43.64 107.41,43.64 106.59,42.83 100.32,42.83 99.36,43.79 U$14.34/A15
SCL
  Bottom(3v3GND) 0.508: U$8.3 65.82,40.19 R27.1 64.99,39.92 64.18,39.11 62.65,39.11 61.26,40.5 U$14.19/A5/SCL
SCL-H  (via drill 0.25)
  Top(3v3+) 0.305: U$21.12 79.45,52.31 80.13,51.64 80.13,49.15 v79.95,48.98 | U$17.12 46.79,51.73 46.88,51.64 46.88,49.86 46.7,49.69 v46.17,49.69
  Bottom(3v3GND) 0.305: v79.95,48.98 79.95,48.26 77.82,46.13 77.82,42.93 78.53,42.22 81.02,42.22 82.8,40.44 82.8,39.2 80.13,39.2 80.13,40.09 80.12,40.1 R33.1 | U$8.6 72.58,40.19 72.05,39.65 72.05,37.23 70.46,35.64 63.06,35.64 57.55,41.15 57.55,45.6 57.37,45.77 53.99,45.77 50.21,49.56 46.72,49.56 46.59,49.69 v46.17,49.69
  Bottom(3v3GND) 0.508: U$8.6 75.78,40.19 76.57,40.97 79.24,40.97 R33.1
SDA
  Bottom(3v3GND) 0.508: U$8.4 64.08,41.46 | 64.08,41.46 63.41,40.8 R7.1 | U$14.18/A4/SDA 64.08,43.69 64.08,41.46
SDA-H  (via drill 0.25)
  Top(3v3+) 0.305: U$21.13 78.27,51.64 79.24,51.64 79.59,51.29 79.59,49.86 v78.88,49.15 | U$17.13 45.84,51.08 v46.17,50.75
  Bottom(3v3GND) 0.305: 75.15,41.63 75.15,45.6 78.71,49.15 v78.88,49.15 | v46.17,50.75 46.91,50.02 50.75,50.02 54.28,46.49 58.34,46.49 60.06,44.76 60.06,39.35 63.24,36.17 70.35,36.17 71.59,37.42 71.59,41.33 71.72,41.46 U$8.5
  Bottom(3v3GND) 0.508: R34.1 81.19,40.97 80.71,41.46 79.69,41.46 79.51,41.63 76.3,41.63 | U$8.5 76.12,41.46 76.3,41.63 | 75.15,41.63 76.3,41.63
TO_DRIB
  Bottom(3v3GND) 0.813: 6.13,81.76 6.7,82.33 | 17.67,82.33 DRIB_TRAN.DRAIN
  Bottom(3v3GND) 1.27: DRIB.2 6.13,81.76 | 6.7,82.33 17.67,82.33
TX  (via drill 0.25)
  Top(3v3+) 0.152: U$15.3 116.4,93.6 117.47,92.54 117.47,70.67 124.22,63.91 126.53,63.91 127.07,63.38 127.07,49.86 125.82,48.62 121.52,48.62 119.64,46.74 109.36,46.74 v106.62,44
  Bottom(3v3GND) 0.152: v106.62,44 101.92,44 U$14.33/A14

## Text on the board
Dimension: Dimensions in mm
Document: MOTHERBOARD